# EAGLE design tsc (EAGLE 9.7.0)
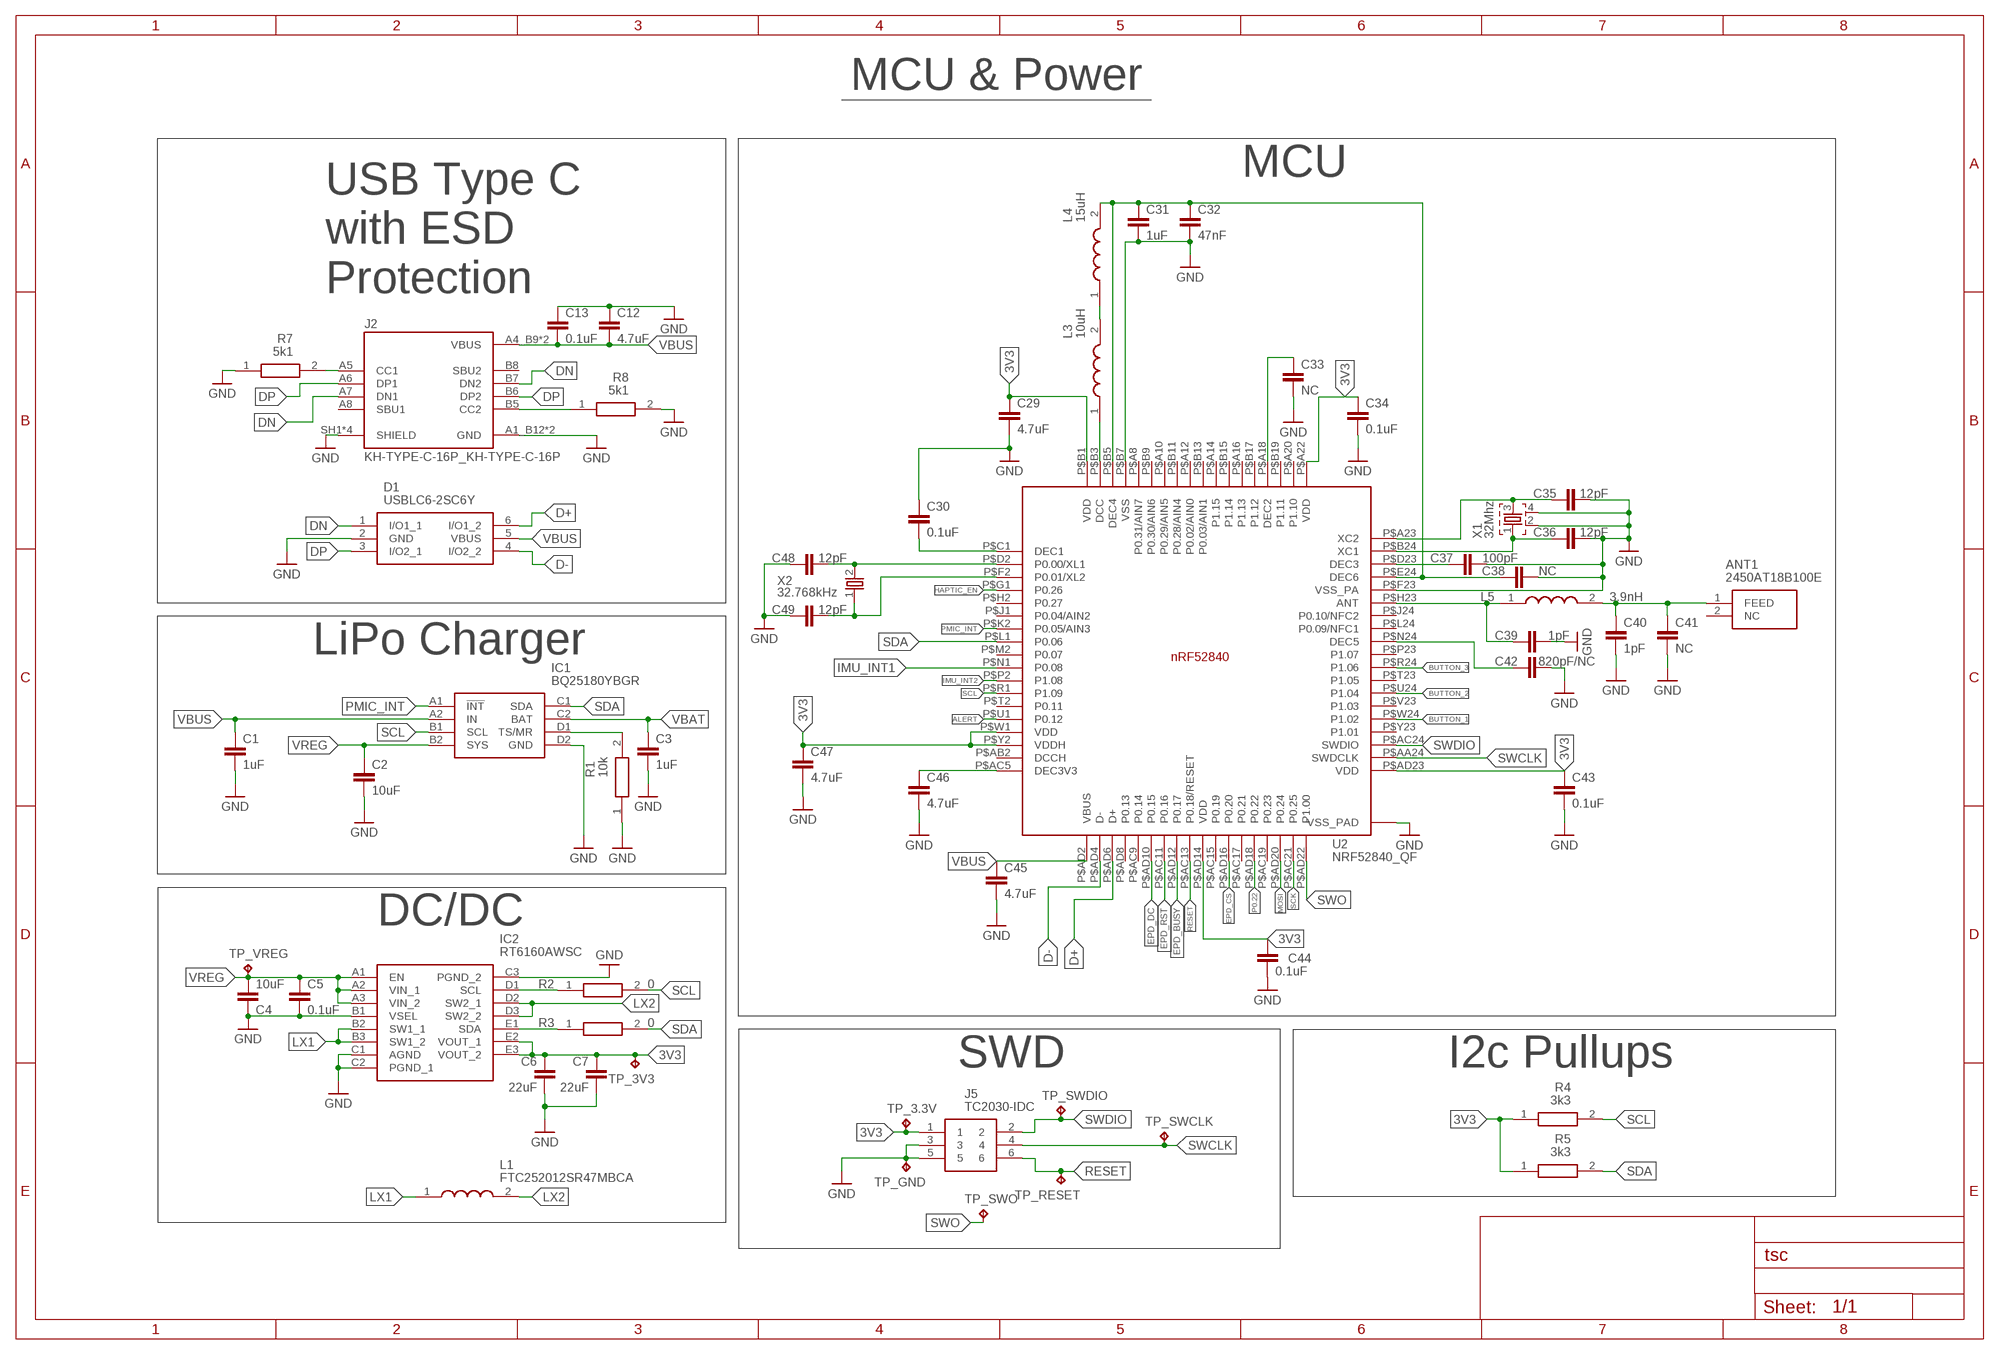
[diagram p0: schematic, sheet 1, part 1 of 2]
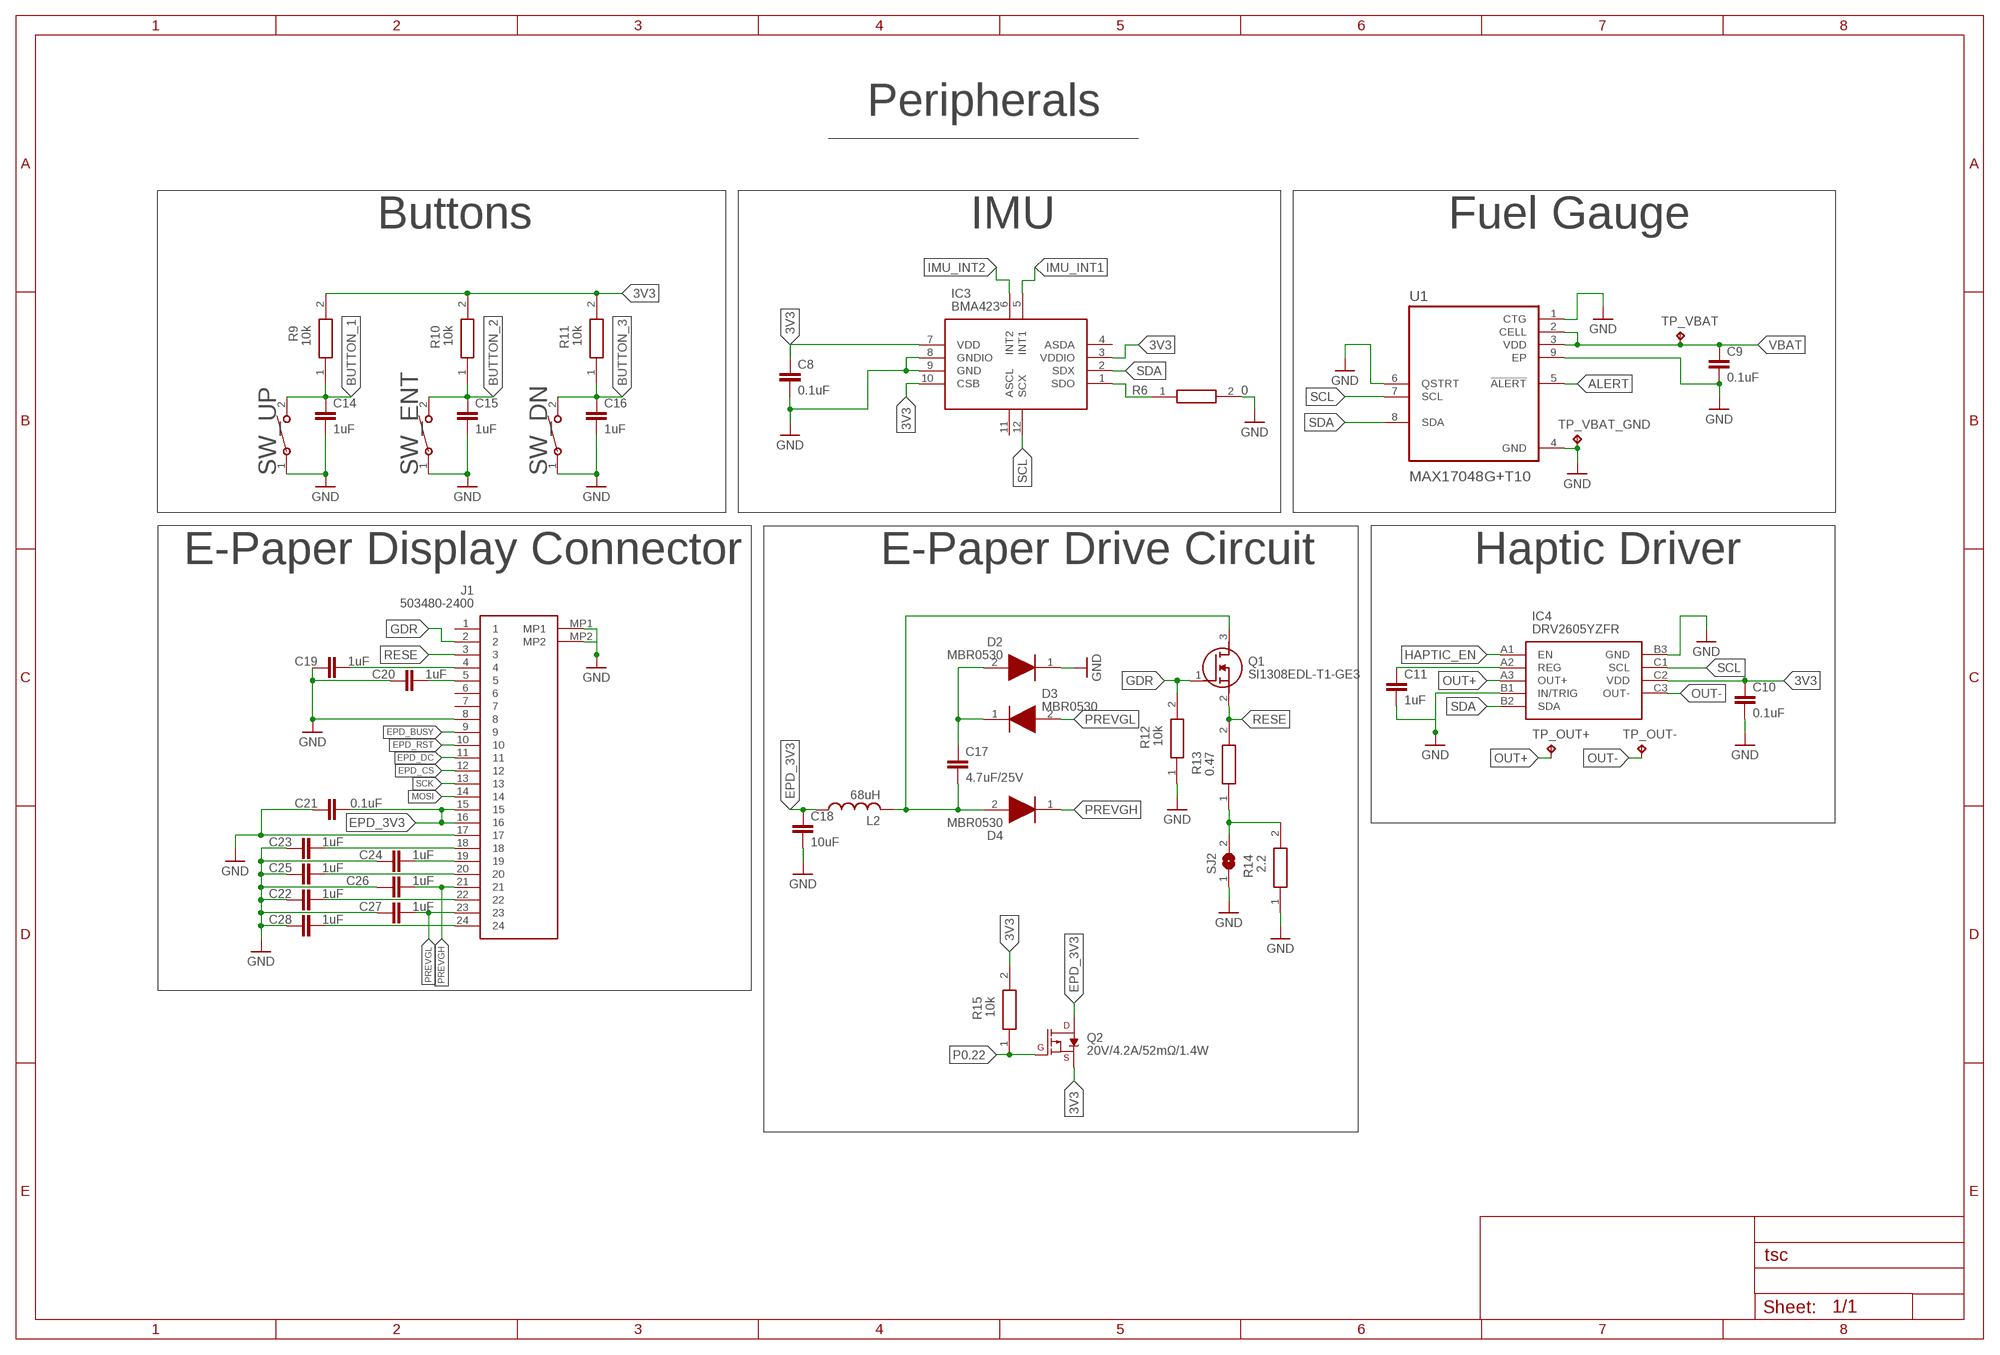
[diagram p1: schematic, sheet 1, part 2 of 2]

## Parts
ANT1  2450AT18B100E  2450AT18B100E_2450AT18B100E  [2450AT18B100E_ANTC3216X140N]
C1  1uF  NORDIC_NRF_3_CAPACITOR_0402_N  [NORDIC_NRF_3_RESC0402_N]
C2  10uF  NORDIC_NRF_3_CAPACITOR_0402_N  [NORDIC_NRF_3_RESC0402_N]
C3  1uF  NORDIC_NRF_3_CAPACITOR_0402_N  [NORDIC_NRF_3_RESC0402_N]
C4  10uF  NORDIC_NRF_3_CAPACITOR_0402_N  [NORDIC_NRF_3_RESC0402_N]
C5  0.1uF  NORDIC_NRF_3_CAPACITOR_0201_N  [NORDIC_NRF_3_RESC0201_N]
C6  22uF  NORDIC_NRF_3_CAPACITOR_0402_N  [NORDIC_NRF_3_RESC0402_N]
C7  22uF  NORDIC_NRF_3_CAPACITOR_0402_N  [NORDIC_NRF_3_RESC0402_N]
C8  0.1uF  NORDIC_NRF_3_CAPACITOR_0201_N  [NORDIC_NRF_3_RESC0201_N]
C9  0.1uF  NORDIC_NRF_3_CAPACITOR_0201_N  [NORDIC_NRF_3_RESC0201_N]
C10  0.1uF  NORDIC_NRF_3_CAPACITOR_0201_N  [NORDIC_NRF_3_RESC0201_N]
C11  1uF  NORDIC_NRF_3_CAPACITOR_0402_N  [NORDIC_NRF_3_RESC0402_N]
C12  4.7uF  NORDIC_NRF_3_CAPACITOR_0402_N  [NORDIC_NRF_3_RESC0402_N]
C13  0.1uF  NORDIC_NRF_3_CAPACITOR_0201_N  [NORDIC_NRF_3_RESC0201_N]
C14  1uF  NORDIC_NRF_3_CAPACITOR_0402_N  [NORDIC_NRF_3_RESC0402_N]
C15  1uF  NORDIC_NRF_3_CAPACITOR_0402_N  [NORDIC_NRF_3_RESC0402_N]
C16  1uF  NORDIC_NRF_3_CAPACITOR_0402_N  [NORDIC_NRF_3_RESC0402_N]
C17  4.7uF/25V  NORDIC_NRF_3_CAPACITOR_0402_N  [NORDIC_NRF_3_RESC0402_N]
C18  10uF  NORDIC_NRF_3_CAPACITOR_0402_N  [NORDIC_NRF_3_RESC0402_N]
C19  1uF  NORDIC_NRF_3_CAPACITOR_0402_N  [NORDIC_NRF_3_RESC0402_N]
C20  1uF  NORDIC_NRF_3_CAPACITOR_0402_N  [NORDIC_NRF_3_RESC0402_N]
C21  0.1uF  NORDIC_NRF_3_CAPACITOR_0201_N  [NORDIC_NRF_3_RESC0201_N]
C22  1uF  NORDIC_NRF_3_CAPACITOR_0402_N  [NORDIC_NRF_3_RESC0402_N]
C23  1uF  NORDIC_NRF_3_CAPACITOR_0402_N  [NORDIC_NRF_3_RESC0402_N]
C24  1uF  NORDIC_NRF_3_CAPACITOR_0402_N  [NORDIC_NRF_3_RESC0402_N]
C25  1uF  NORDIC_NRF_3_CAPACITOR_0402_N  [NORDIC_NRF_3_RESC0402_N]
C26  1uF  NORDIC_NRF_3_CAPACITOR_0402_N  [NORDIC_NRF_3_RESC0402_N]
C27  1uF  NORDIC_NRF_3_CAPACITOR_0402_N  [NORDIC_NRF_3_RESC0402_N]
C28  1uF  NORDIC_NRF_3_CAPACITOR_0402_N  [NORDIC_NRF_3_RESC0402_N]
C29  4.7uF  NORDIC_NRF_3_CAPACITOR_0402_N  [NORDIC_NRF_3_RESC0402_N]
C30  0.1uF  NORDIC_NRF_3_CAPACITOR_0201_N  [NORDIC_NRF_3_RESC0201_N]
C31  1uF  NORDIC_NRF_3_CAPACITOR_0402_N  [NORDIC_NRF_3_RESC0402_N]
C32  47nF  NORDIC_NRF_3_CAPACITOR_0201_N  [NORDIC_NRF_3_RESC0201_N]
C33  NC  NORDIC_NRF_3_CAPACITOR_0201_N  [NORDIC_NRF_3_RESC0201_N]
C34  0.1uF  NORDIC_NRF_3_CAPACITOR_0201_N  [NORDIC_NRF_3_RESC0201_N]
C35  12pF  NORDIC_NRF_3_CAPACITOR_0201_N  [NORDIC_NRF_3_RESC0201_N]
C36  12pF  NORDIC_NRF_3_CAPACITOR_0201_N  [NORDIC_NRF_3_RESC0201_N]
C37  100pF  NORDIC_NRF_3_CAPACITOR_0201_N  [NORDIC_NRF_3_RESC0201_N]
C38  NC  NORDIC_NRF_3_CAPACITOR_0201_N  [NORDIC_NRF_3_RESC0201_N]
C39  1pF  NORDIC_NRF_3_CAPACITOR_0201_N  [NORDIC_NRF_3_RESC0201_N]
C40  1pF  NORDIC_NRF_3_CAPACITOR_0201_N  [NORDIC_NRF_3_RESC0201_N]
C41  NC  NORDIC_NRF_3_CAPACITOR_0201_N  [NORDIC_NRF_3_RESC0201_N]
C42  820pF/NC  NORDIC_NRF_3_CAPACITOR_0201_N  [NORDIC_NRF_3_RESC0201_N]
C43  0.1uF  NORDIC_NRF_3_CAPACITOR_0201_N  [NORDIC_NRF_3_RESC0201_N]
C44  0.1uF  NORDIC_NRF_3_CAPACITOR_0201_N  [NORDIC_NRF_3_RESC0201_N]
C45  4.7uF  NORDIC_NRF_3_CAPACITOR_0402_N  [NORDIC_NRF_3_RESC0402_N]
C46  4.7uF  NORDIC_NRF_3_CAPACITOR_0402_N  [NORDIC_NRF_3_RESC0402_N]
C47  4.7uF  NORDIC_NRF_3_CAPACITOR_0402_N  [NORDIC_NRF_3_RESC0402_N]
C48  12pF  NORDIC_NRF_3_CAPACITOR_0201_N  [NORDIC_NRF_3_RESC0201_N]
C49  12pF  NORDIC_NRF_3_CAPACITOR_0201_N  [NORDIC_NRF_3_RESC0201_N]
D1  USBLC6-2SC6Y  ESP32_C6_LIBRARY_3_USBLC6-2SC6Y  [ESP32_C6_LIBRARY_3_SOT95P280X145-6N]
D2  MBR0530  ESP32_C6_LIBRARY_5_MBR0530  [ESP32_C6_LIBRARY_5_SOD3716X135N]
D3  MBR0530  ESP32_C6_LIBRARY_5_MBR0530  [ESP32_C6_LIBRARY_5_SOD3716X135N]
D4  MBR0530  ESP32_C6_LIBRARY_5_MBR0530  [ESP32_C6_LIBRARY_5_SOD3716X135N]
IC1  BQ25180YBGR  BQ25180YBGR_BQ25180YBGR  [BQ25180YBGR_BGA8C40P2X4_100X155X50]
IC2  RT6160AWSC  RT6160AWSC_RT6160AWSC  [RT6160AWSC_BGA15C40P3X5_140X230X60]
IC3  BMA423  BMA423_BMA423  [BMA423_BMA423]
IC4  DRV2605YZFR  DRV2605YZFR_DRV2605YZFR  [DRV2605YZFR_BGA9C50P3X3_144X144X62]
J1  503480-2400  503480-2400_503480-2400  [503480-2400_5034802400]
J2  KH-TYPE-C-16P_KH-TYPE-C-16P  [KH-TYPE-C-16P_KINGHELM_KH-TYPE-C-16P]
J5  TC2030-IDC  TC2030-IDC_TC2030-IDC  [TC2030-IDC_TC2030IDC]
L1  FTC252012SR47MBCA  MLP2016SR47MT0S1_FTC252012SR47MBCA  [MLP2016SR47MT0S1_INDC2016X100N]
L2  68uH  NORDIC_NRF_2_INDUCTOR_0402_L  [NORDIC_NRF_2_RESC0402_L]
L3  10uH  MLP2016SR47MT0S1_FTC252012SR47MBCA  [MLP2016SR47MT0S1_INDC2016X100N]
L4  15uH  MLP2016SR47MT0S1_FTC252012SR47MBCA  [MLP2016SR47MT0S1_INDC2016X100N]
L5  3.9nH  MLP2016SR47MT0S1_FTC252012SR47MBCA  [MLP2016SR47MT0S1_INDC2016X100N]
Q1  SI1308EDL-T1-GE3  ESP32_C6_LIBRARY_6_SI1308EDL-T1-GE3  [ESP32_C6_LIBRARY_6_SOT65P210X110-3N]
Q2  20V/4.2A/52mΩ/1.4W  ESP32_C6_LIBRARY_4_ESP32_WROVER_SPARKFUN-DISCRETESEMI_MOSFET_PCH-DMG2305UX-7  [ESP32_C6_LIBRARY_4_ESP32_C6_LIBRARY_4_ESP32_C6_LIBRARY_4_ESP32_C6_LIBRARY_4_ESP32_WROVER_SPARKFUN-DISCRETESEMI_SOT23-3]
R1  10k  CPF0201D7K68C1_CPF0201D7K68C1  [CPF0201D7K68C1_0201]
R2  0  CPF0201D7K68C1_CPF0201D7K68C1  [CPF0201D7K68C1_0201]
R3  0  CPF0201D7K68C1_CPF0201D7K68C1  [CPF0201D7K68C1_0201]
R4  3k3  CPF0201D7K68C1_CPF0201D7K68C1  [CPF0201D7K68C1_0201]
R5  3k3  CPF0201D7K68C1_CPF0201D7K68C1  [CPF0201D7K68C1_0201]
R6  0  CPF0201D7K68C1_CPF0201D7K68C1  [CPF0201D7K68C1_0201]
R7  5k1  CPF0201D7K68C1_CPF0201D7K68C1  [CPF0201D7K68C1_0201]
R8  5k1  CPF0201D7K68C1_CPF0201D7K68C1  [CPF0201D7K68C1_0201]
R9  10k  CPF0201D7K68C1_CPF0201D7K68C1  [CPF0201D7K68C1_0201]
R10  10k  CPF0201D7K68C1_CPF0201D7K68C1  [CPF0201D7K68C1_0201]
R11  10k  CPF0201D7K68C1_CPF0201D7K68C1  [CPF0201D7K68C1_0201]
R12  10k  CPF0201D7K68C1_CPF0201D7K68C1  [CPF0201D7K68C1_0201]
R13  0.47  CPF0201D7K68C1_CPF0201D7K68C1  [CPF0201D7K68C1_0201]
R14  2.2  CPF0201D7K68C1_CPF0201D7K68C1  [CPF0201D7K68C1_0201]
R15  10k  CPF0201D7K68C1_CPF0201D7K68C1  [CPF0201D7K68C1_0201]
SJ2  -  ESP32_C6_LIBRARY_7_JUMPER_SJ  [ESP32_C6_LIBRARY_7_JUMPER_SJ]
SW_DN  2025-10-22_07-23-44_LIBRARY_EVP-AKE31ASW_EVP-AKE31A_PAN  [2025-10-22_07-23-44_LIBRARY_SW_EVP-AKE31A_PAN]
SW_ENT  2025-10-22_07-23-44_LIBRARY_EVP-AKE31ASW_EVP-AKE31A_PAN  [2025-10-22_07-23-44_LIBRARY_SW_EVP-AKE31A_PAN]
SW_UP  2025-10-22_07-23-44_LIBRARY_EVP-AKE31ASW_EVP-AKE31A_PAN  [2025-10-22_07-23-44_LIBRARY_SW_EVP-AKE31A_PAN]
TP_3.3V  HECTOR_WATCH_1_TPTP20R  [HECTOR_WATCH_1_TP20R]
TP_3V3  HECTOR_WATCH_1_TPTP20R  [HECTOR_WATCH_1_TP20R]
TP_GND  HECTOR_WATCH_1_TPTP20R  [HECTOR_WATCH_1_TP20R]
TP_OUT+  HECTOR_WATCH_1_TPTP20R  [HECTOR_WATCH_1_TP20R]
TP_OUT-  HECTOR_WATCH_1_TPTP20R  [HECTOR_WATCH_1_TP20R]
TP_RESET  HECTOR_WATCH_1_TPTP20R  [HECTOR_WATCH_1_TP20R]
TP_SWCLK  HECTOR_WATCH_1_TPTP20R  [HECTOR_WATCH_1_TP20R]
TP_SWDIO  HECTOR_WATCH_1_TPTP20R  [HECTOR_WATCH_1_TP20R]
TP_SWO  HECTOR_WATCH_1_TPTP20R  [HECTOR_WATCH_1_TP20R]
TP_VBAT  HECTOR_WATCH_1_TPTP20R  [HECTOR_WATCH_1_TP20R]
TP_VBAT_GND  HECTOR_WATCH_1_TPTP20R  [HECTOR_WATCH_1_TP20R]
TP_VREG  HECTOR_WATCH_1_TPTP20R  [HECTOR_WATCH_1_TP20R]
U1  MAX17048G+T10  ESP32_C6_LIBRARY_MAX17048G+T10  [ESP32_C6_LIBRARY_SON50P200X200X80-9N]
U2  NRF52840_QF  NORDIC_NRF_4_NRF52840_QF  [NORDIC_NRF_4_AQFN50P700X700X85_HS-74N]
X1  32Mhz  NORDIC_NRF_XTAL_32MHZ  [NORDIC_NRF_BT-XTAL_2016_N]
X2  32.768kHz  NORDIC_NRF_1_XTAL_32KHZ  [NORDIC_NRF_1_XTAL_3215_N]

## Nets
3V3: C6.1 C7.1 C8.1 C10.1 C29.1 C34.1 C43.1 C44.1 C47.1 IC2.E2(VOUT_1) IC2.E3(VOUT_2) IC3.3(VDDIO) IC3.7(VDD) IC3.10(CSB) IC4.C2(VDD) J5.1 Q2.2(S) R4.1 R5.1 R9.2 R10.2 R11.2 R15.2 TP_3.3V.TP TP_3V3.TP U2.P$A22(VDD) U2.P$AD14(VDD) U2.P$AD23(VDD) U2.P$B1(VDD) U2.P$W1(VDD) U2.P$Y2(VDDH)
ALERT: U1.5(!ALERT) U2.P$U1(P0.12)
BUTTON_1: C14.1 R9.1 SW_UP.2 U2.P$W24(P1.02)
BUTTON_2: C15.1 R10.1 SW_ENT.2 U2.P$U24(P1.04)
BUTTON_3: C16.1 R11.1 SW_DN.2 U2.P$R24(P1.06)
D+: D1.6(I/O1_2) U2.P$AD6(D+)
D-: D1.4(I/O2_2) U2.P$AD4(D-)
DN: D1.1(I/O1_1) J2.A7(DN1) J2.B7(DN2)
DP: D1.3(I/O2_1) J2.A6(DP1) J2.B6(DP2)
EPD_3V3: C18.1 C21.2 J1.15 J1.16 L2.1 Q2.3(D)
EPD_BUSY: J1.9 U2.P$AD12(P0.17)
EPD_CS: J1.12 U2.P$AD16(P0.20)
EPD_DC: J1.11 U2.P$AD10(P0.15)
EPD_RST: J1.10 U2.P$AC11(P0.16)
GDR: J1.2 Q1.1(G) R12.2
GND: C1.2 C2.2 C3.2 C4.1 C5.2 C6.2 C7.2 C8.2 C9.2 C10.2 C11.2 C12.1 C13.1 C14.2 C15.2 C16.2 C18.2 C19.1 C20.1 C21.1 C22.1 C23.1 C24.1 C25.1 C26.1 C27.1 C28.1 C29.2 C30.1 C31.2 C32.2 C33.2 C34.2 C35.2 C36.2 C37.2 C38.2 C39.2 C40.2 C41.2 C42.2 C43.2 C44.2 C45.2 C46.2 C47.2 C48.1 C49.1 D1.2(GND) D2.1(K) IC1.D2(GND) IC2.B1(VSEL) IC2.C1(AGND) IC2.C2(PGND_1) IC2.C3(PGND_2) IC3.8(GNDIO) IC3.9(GND) IC4.B1(IN/TRIG) IC4.B3(GND) J1.8 J1.17 J1.MP1 J1.MP2 J2.A1_B12(GND) J2.A12_B1(GND) J2.SH1(SHIELD) J2.SH2(SHIELD) J2.SH3(SHIELD) J2.SH4(SHIELD) J5.3 J5.5 R1.1 R6.2 R7.1 R8.2 R12.1 R14.1 SJ2.1 SW_DN.1 SW_ENT.1 SW_UP.1 TP_GND.TP TP_VBAT_GND.TP U1.1(CTG) U1.4(GND) U1.6(QSTRT) U1.9(EP) U2.P$74(VSS_PAD) U2.P$75(VSS_PAD) U2.P$76(VSS_PAD) U2.P$77(VSS_PAD) U2.P$78(VSS_PAD) U2.P$79(VSS_PAD) U2.P$80(VSS_PAD) U2.P$81(VSS_PAD) U2.P$82(VSS_PAD) U2.P$83(VSS_PAD) U2.P$84(VSS_PAD) U2.P$85(VSS_PAD) U2.P$86(VSS_PAD) U2.P$87(VSS_PAD) U2.P$88(VSS_PAD) U2.P$89(VSS_PAD) U2.P$90(VSS_PAD) U2.P$B7(VSS) U2.P$F23(VSS_PA) X1.2 X1.4
HAPTIC_EN: IC4.A1(EN) U2.P$G1(P0.26)
IMU_INT1: IC3.5(INT1) U2.P$N1(P0.08)
IMU_INT2: IC3.6(INT2) U2.P$P2(P1.08)
LX1: IC2.B2(SW1_1) IC2.B3(SW1_2) L1.1
LX2: IC2.D2(SW2_1) IC2.D3(SW2_2) L1.2
MOSI: J1.14 U2.P$AD20(P0.24)
N$1: IC1.D1(TS/MR) R1.2
N$5: IC2.D1(SCL) R2.1
N$8: IC2.E1(SDA) R3.1
N$20: IC3.1(SDO) R6.1
N$27: C11.1 IC4.A2(REG)
N$31: J2.A5(CC1) R7.2
N$37: C17.1 D2.2(A) D3.1(K)
N$38: J2.B5(CC2) R8.1
N$40: C17.2 D4.2(A) L2.2 Q1.3(D)
N$48: R13.1 R14.2 SJ2.2
N$50: C19.2 J1.4
N$51: C20.2 J1.5
N$54: C23.2 J1.18
N$55: C24.2 J1.19
N$56: C25.2 J1.20
N$58: C22.2 J1.22
N$60: C28.2 J1.24
N$63: C30.2 U2.P$C1(DEC1)
N$64: L3.1 U2.P$B3(DCC)
N$65: L3.2 L4.1
N$66: C31.1 C32.1 C38.1 L4.2 U2.P$B5(DEC4) U2.P$E24(DEC6)
N$71: C33.1 U2.P$A18(DEC2)
N$73: C36.1 U2.P$B24(XC1) X1.1
N$74: C35.1 U2.P$A23(XC2) X1.3
N$75: C37.1 U2.P$D23(DEC3)
N$77: C39.1 L5.1 U2.P$H23(ANT)
N$78: ANT1.1(FEED) C40.1 C41.1 L5.2
N$80: C42.1 U2.P$N24(DEC5)
N$94: C46.1 U2.P$AC5(DEC3V3)
N$103: C48.2 U2.P$D2(P0.00/XL1) X2.2
N$104: C49.2 U2.P$F2(P0.01/XL2) X2.1
OUT+: IC4.A3(OUT+) TP_OUT+.TP
OUT-: IC4.C3(OUT-) TP_OUT-.TP
P0.22: Q2.1(G) R15.1 U2.P$AD18(P0.22)
PMIC_INT: IC1.A1(!INT) U2.P$K2(P0.05/AIN3)
PREVGH: C26.2 D4.1(K) J1.21
PREVGL: C27.2 D3.2(A) J1.23
RESE: J1.3 Q1.2(S) R13.2
RESET: J5.6 TP_RESET.TP U2.P$AC13(P0.18/RESET)
SCK: J1.13 U2.P$AC21(P0.25)
SCL: IC1.B1(SCL) IC3.12(SCX) IC4.C1(SCL) R2.2 R4.2 U1.7(SCL) U2.P$R1(P1.09)
SDA: IC1.C1(SDA) IC3.2(SDX) IC4.B2(SDA) R3.2 R5.2 U1.8(SDA) U2.P$L1(P0.06)
SWCLK: J5.4 TP_SWCLK.TP U2.P$AA24(SWDCLK)
SWDIO: J5.2 TP_SWDIO.TP U2.P$AC24(SWDIO)
SWO: TP_SWO.TP U2.P$AD22(P1.00)
VBAT: C3.1 C9.1 IC1.C2(BAT) TP_VBAT.TP U1.2(CELL) U1.3(VDD)
VBUS: C1.1 C12.2 C13.2 C45.1 D1.5(VBUS) IC1.A2(IN) J2.A4_B9(VBUS) J2.A9_B4(VBUS) U2.P$AD2(VBUS)
VREG: C2.1 C4.2 C5.1 IC1.B2(SYS) IC2.A1(EN) IC2.A2(VIN_1) IC2.A3(VIN_2) TP_VREG.TP
Unconnected: ANT1.2(NC) IC3.4(ASDA) IC3.11(ASCL) J1.1 J1.6 J1.7 J2.A8(SBU1) J2.B8(SBU2) U2.P$A8(P0.31/AIN7) U2.P$A10(P0.29/AIN5) U2.P$A12(P0.02/AIN0) U2.P$A14(P1.15) U2.P$A16(P1.13) U2.P$A20(P1.10) U2.P$AB2(DCCH) U2.P$AC9(P0.14) U2.P$AC15(P0.19) U2.P$AC17(P0.21) U2.P$AC19(P0.23) U2.P$AD8(P0.13) U2.P$B9(P0.30/AIN6) U2.P$B11(P0.28/AIN4) U2.P$B13(P0.03/AIN1) U2.P$B15(P1.14) U2.P$B17(P1.12) U2.P$B19(P1.11) U2.P$H2(P0.27) U2.P$J1(P0.04/AIN2) U2.P$J24(P0.10/NFC2) U2.P$L24(P0.09/NFC1) U2.P$M2(P0.07) U2.P$P23(P1.07) U2.P$T2(P0.11) U2.P$T23(P1.05) U2.P$V23(P1.03) U2.P$Y23(P1.01)

## Notes on the sheet
- MCU & Power
- MCU
- USB Type C
  with ESD
  Protection
- LiPo Charger
- DC/DC
- SWD | I2c Pullups
- Peripherals
- Buttons | IMU | Fuel Gauge
- E-Paper Display Connector | E-Paper Drive Circuit | Haptic Driver

## Library data of the parts
ANT1 = InkTime_v5:2450AT18B100E_2450AT18B100E: Antennas 2.45GHz ANTENNA Source: Datasheet <https://www.johansontechnology.com/datasheets/2450AT18B100/2450AT18B100.pdf>; ARROW_PART_NUMBER: 2450AT18B100E; ARROW_PRICE-STOCK: https://www.arrow.com/en/products/2450at18b100e/johanson-dielectrics?utm_currency=USD&region=nac; DESCRIPTION: Antennas 2.45GHz ANTENNA; HEIGHT: 1.4mm; MANUFACTURER_NAME: JOHANSON TECHNOLOGY; MANUFACTURER_PART_NUMBER: 2450AT18B100E; MOUSER_PART_NUMBER: 609-2450AT18B100E; MOUSER_PRICE-STOCK: https://www.mouser.co.uk/ProductDetail/Johanson-Technology/2450AT18B100E?qs=yCnrNFeXz%252Bh5MFsFIXGZGA%3D%3D
C1-C49 = InkTime_v5:NORDIC_NRF_3_CAPACITOR: Generic chip capacitor
D1 = InkTime_v5:ESP32_C6_LIBRARY_3_USBLC6-2SC6Y: Low Cap. ESD Protection Auto SOT-23-6 STMicroelectronics USBLC6-2SC6Y, Dual Uni-Directional TVS Diode Array, 6-Pin SOT-23 Source: Datasheet <https://componentsearchengine.com/Datasheets/1/USBLC6-2SC6Y.pdf> Check availability <https://pricing.snapeda.com/parts/USBLC6-2SC6Y/STMicroelectronics/view-part?ref=eda>; AVAILABILITY: In Stock; CHECK_PRICES: https://www.snapeda.com/parts/USBLC6-2SC6Y/STMicroelectronics/view-part/?ref=eda; DESCRIPTION: 17V Clamp 5A (8/20µs) Ipp Tvs Diode Surface Mount SOT-23-6; MF: STMicroelectronics; MP: USBLC6-2SC6Y; PACKAGE: SOT-23-6 STMicroelectronics; PRICE: None; SNAPEDA_LINK: https://www.snapeda.com/parts/USBLC6-2SC6Y/STMicroelectronics/view-part/?ref=snap
D2-D4 = InkTime_v5:ESP32_C6_LIBRARY_5_MBR0530: ON SEMICONDUCTOR - MBR0530 - DIODE, SCHOTTKY, 0.5A, 30V, SOD-123 Source: Datasheet <http://www.onsemi.com/pub/Collateral/MBR0530T1-D.PDF> Check availability <https://pricing.snapeda.com/parts/MBR0530/ON%20Semiconductor/view-part?ref=eda>; AVAILABILITY: In Stock; CHECK_PRICES: https://www.snapeda.com/parts/MBR0530/Onsemi/view-part/?ref=eda; DESCRIPTION: Diode Schottky 30 V 500mA Surface Mount SOD-123; MF: ON Semiconductor; MP: MBR0530; PACKAGE: SOD-123-2 ON Semiconductor; PRICE: None; PURCHASE-URL: https://www.snapeda.com/api/url_track_click_mouser/?unipart_id=179458&manufacturer=ON Semiconductor&part_name=MBR0530&search_term=None; SNAPEDA_LINK: https://www.snapeda.com/parts/MBR0530/Onsemi/view-part/?ref=snap
IC1 = InkTime_v5:BQ25180YBGR_BQ25180YBGR: Charger IC Lithium Ion/Polymer, Lithium Iron Phosphate 8-DSBGA (1.6x1.1) Source: Datasheet <https://www.ti.com/lit/ds/symlink/bq25180.pdf?ts=1650264094470&ref_url=https%3A%2F%2Fwww.ti.com%2Fproduct%2FBQ25180>; ARROW_PART_NUMBER: BQ25180YBGR; ARROW_PRICE-STOCK: https://www.arrow.com/en/products/bq25180ybgr/texas-instruments?utm_currency=USD&region=nac; DESCRIPTION: Charger IC Lithium Ion/Polymer, Lithium Iron Phosphate 8-DSBGA (1.6x1.1); HEIGHT: 0.5mm; MANUFACTURER_NAME: Texas Instruments; MANUFACTURER_PART_NUMBER: BQ25180YBGR; MOUSER_PART_NUMBER: 595-BQ25180YBGR; MOUSER_PRICE-STOCK: https://www.mouser.co.uk/ProductDetail/Texas-Instruments/BQ25180YBGR?qs=doiCPypUmgEWjAK%252BJAX6Tw%3D%3D
IC2 = InkTime_v5:RT6160AWSC_RT6160AWSC: Buck-Boost Regulator Positive Output Step-Up/Step-Down I2C DC-DC Controller IC 15-WL-CSP (BSC) (1.4x2.3) Source: Datasheet <https://www.richtek.com/SaveDownload.aspx?specid=RT6160A>; DESCRIPTION: Buck-Boost Regulator Positive Output Step-Up/Step-Down I2C DC-DC Controller IC 15-WL-CSP (BSC) (1.4x2.3); HEIGHT: 0.6mm; MANUFACTURER_NAME: RICHTEK; MANUFACTURER_PART_NUMBER: RT6160AWSC; MOUSER_PART_NUMBER: 835-RT6160AWSC; MOUSER_PRICE-STOCK: https://www.mouser.co.uk/ProductDetail/Richtek/RT6160AWSC?qs=amGC7iS6iy%2FLd9PSoixZXQ%3D%3D
IC3 = InkTime_v5:BMA423_BMA423: Accelerometers Triaxial low-g 12bit Acceleration Sensor Source: Datasheet <https://www.mouser.com/datasheet/2/783/BST-BMA423-DS000-1509600.pdf>; ARROW_PART_NUMBER: BMA423; ARROW_PRICE-STOCK: https://www.arrow.com/en/products/bma423/bosch; DESCRIPTION: Accelerometers Triaxial low-g 12bit Acceleration Sensor; HEIGHT: 1mm; MANUFACTURER_NAME: BOSCH; MANUFACTURER_PART_NUMBER: BMA423; MOUSER_PART_NUMBER: 262-BMA423; MOUSER_PRICE-STOCK: https://www.mouser.co.uk/ProductDetail/Bosch-Sensortec/BMA423?qs=HXFqYaX1Q2xC%252BSgeGoX3mg%3D%3D
IC4 = InkTime_v5:DRV2605YZFR_DRV2605YZFR: Haptic Driver for ERM/LRA with Built-In Library and Smart Loop Architecture Source: Datasheet <http://www.ti.com/lit/gpn/drv2605>; ARROW_PART_NUMBER: DRV2605YZFR; ARROW_PRICE-STOCK: https://www.arrow.com/en/products/drv2605yzfr/texas-instruments?region=nac; DESCRIPTION: Haptic Driver for ERM/LRA with Built-In Library and Smart Loop Architecture; HEIGHT: 0.625mm; MANUFACTURER_NAME: Texas Instruments; MANUFACTURER_PART_NUMBER: DRV2605YZFR
J1 = InkTime_v5:503480-2400_503480-2400: FFC & FPC Connectors 0.5mm FPC RA SMT Dual Contact 24Ckt Source: Datasheet <https://componentsearchengine.com/Datasheets/1/503480-2400.pdf>; DESCRIPTION: FFC & FPC Connectors 0.5mm FPC RA SMT Dual Contact 24Ckt; HEIGHT: 1.87mm; MANUFACTURER_NAME: Molex; MANUFACTURER_PART_NUMBER: 503480-2400; MOUSER_PART_NUMBER: 538-503480-2400; MOUSER_PRICE-STOCK: https://www.mouser.co.uk/ProductDetail/Molex/503480-2400?qs=OAhjpuo3Vu7efIoxFh9AOw%3D%3D
J2 = InkTime_v5:KH-TYPE-C-16P_KH-TYPE-C-16P: Check availability <https://pricing.snapeda.com/parts/KH-TYPE-C-16P/kinghelm/view-part?ref=eda>; AVAILABILITY: Not in stock; CHECK_PRICES: https://www.snapeda.com/parts/KH-TYPE-C-16P/Kinghelm/view-part/?ref=eda; MF: kinghelm; MP: KH-TYPE-C-16P; PACKAGE: None; PRICE: None; SNAPEDA_LINK: https://www.snapeda.com/parts/KH-TYPE-C-16P/Kinghelm/view-part/?ref=snap
J5 = InkTime_v5:TC2030-IDC_TC2030-IDC: CABLE ADAPTER 6 POS Source: Datasheet <https://datasheet.datasheetarchive.com/originals/distributors/Datasheets_SAMA/62bc384e093448baaaa63dbd0b9d8707.pdf>; DESCRIPTION: CABLE ADAPTER 6 POS; HEIGHT: 19mm; MANUFACTURER_NAME: Tag Connect; MANUFACTURER_PART_NUMBER: TC2030-IDC
L1 L3-L5 = InkTime_v5:MLP2016SR47MT0S1_FTC252012SR47MBCA: SMD / SMT Inductors (Coils), L=0.47?H, L x W x T : Source: Datasheet <https://product.tdk.com/system/files/dam/doc/product/inductor/inductor/smd/catalog/inductor_commercial_power_mlp2016_en.pdf>; DESCRIPTION: SMD / SMT Inductors (Coils), L=0.47?H, L x W x T :; HEIGHT: 1mm; JLCPCB: https://jlcpcb.com/partdetail/6763488-FTC252012SR47MBCA/C5832368; MANUFACTURER_NAME: TDK; MANUFACTURER_PART_NUMBER: FTC252012SR47MBCA
L2 = InkTime_v5:NORDIC_NRF_2_INDUCTOR: Generic chip inductor
Q1 = InkTime_v5:ESP32_C6_LIBRARY_6_SI1308EDL-T1-GE3: MOSFET N-Ch 30V 1.5A TrenchFET SC70 Vishay Si1308EDL-T1-GE3 N-channel MOSFET Transistor, 1.5 A, 30 V, 3-Pin SC-70 Source: Datasheet <https://componentsearchengine.com/Datasheets/1/SI1308EDL-T1-GE3.pdf> Check availability <https://pricing.snapeda.com/parts/SI1308EDL-T1-GE3/Vishay%20Siliconix/view-part?ref=eda>; AVAILABILITY: In Stock; CHECK_PRICES: https://www.snapeda.com/parts/SI1308EDL-T1-GE3/Vishay+Siliconix/view-part/?ref=eda; DESCRIPTION: Si1308EDL-T1-GE3 N-channel MOSFET Transistor, 1.5 A, 30 V, 3-Pin SC-70 | Siliconix / Vishay SI1308EDL-T1-GE3; MF: Vishay Siliconix; MP: SI1308EDL-T1-GE3; PACKAGE: SOT-323 Vishay Semiconductor; PRICE: None; PURCHASE-URL: https://www.snapeda.com/api/url_track_click_mouser/?unipart_id=274603&manufacturer=Vishay Siliconix&part_name=SI1308EDL-T1-GE3&search_term=None; SNAPEDA_LINK: https://www.snapeda.com/parts/SI1308EDL-T1-GE3/Vishay+Siliconix/view-part/?ref=snap
Q2 = InkTime_v5:ESP32_C6_LIBRARY_4_ESP32_WROVER_SPARKFUN-DISCRETESEMI_MOSFET_PCH: P-channel MOSFETs Voltage controlled devices that allow control of high current outputs. SparkFun Products: SparkFun ESP32 Thing <https://www.sparkfun.com/products/13907> SparkFun ESP8266 Thing <https://www.sparkfun.com/products/13231> SparkFun Pi Servo HAT V2 <https://www.sparkfun.com/products/15316> DMG2305UX-7 (20V/4.2A/SOT23-3); PROD_ID: TRAN-14388
R1-R15 = InkTime_v5:CPF0201D7K68C1_CPF0201D7K68C1: 7.68k 0201 Thin Film Surface Mount Fixed Resistor +/-0.5% 0.031W CPF0201D7K68C1 Source: Datasheet <http://www.te.com/commerce/DocumentDelivery/DDEController?Action=showdoc&DocId=Data Sheet1773200-1ApdfEnglishENG_DS_1773200-1_A.pdf4-2176215-6>
SJ2 = InkTime_v5:ESP32_C6_LIBRARY_7_JUMPER_SJ: SMD solder JUMPER
SW_DN SW_ENT SW_UP = InkTime_v5:2025-10-22_07-23-44_LIBRARY_EVP-AKE31A; COPYRIGHT: Copyright (C) 2025 Ultra Librarian. All rights reserved.; DIGI-KEY_PART_NUMBER_1: P123437TR-ND; DIGI-KEY_PART_NUMBER_2: P123437CT-ND; DIGI-KEY_PART_NUMBER_3: P123437DKR-ND; MANUFACTURER_NAME: Panasonic; MANUFACTURER_PART_NUMBER: EVP-AKE31A
TP_3.3V TP_3V3 TP_GND TP_OUT+ TP_OUT- TP_RESET TP_SWCLK TP_SWDIO TP_SWO TP_VBAT TP_VBAT_GND TP_VREG = InkTime_v5:HECTOR_WATCH_1_TP: Test pad
U1 = InkTime_v5:ESP32_C6_LIBRARY_MAX17048G+T10: Check availability <https://pricing.snapeda.com/parts/MAX17048G%2BT10/Analog%20Devices/view-part?ref=eda>; AVAILABILITY: In Stock; CHECK_PRICES: https://www.snapeda.com/parts/MAX17048G+T10/Analog+Devices/view-part/?ref=eda; DESCRIPTION: 3µA 1-Cell/2-Cell Fuel Gauge with ModelGauge; MF: Analog Devices; MP: MAX17048G+T10; PACKAGE: TDFN-8 Maxim; PRICE: None; PURCHASE-URL: https://www.snapeda.com/api/url_track_click_mouser/?unipart_id=329239&manufacturer=Analog Devices&part_name=MAX17048G+T10&search_term=None; SNAPEDA_LINK: https://www.snapeda.com/parts/MAX17048G+T10/Analog+Devices/view-part/?ref=snap
U2 = InkTime_v5:NORDIC_NRF_4_NRF52840_QF: nRF52840 Features Advanced Single chip 2.4 GHz multi-protocol SoC 32-bit ARM Cortex-M4F Processor 1.7v to 5.5v operation 1MB flash + 256kB RAM Bluetooth 5 support for long range and high throughput 802.15.4 radio support On-chip NFC PPI –Programmable Peripheral Interconnect Automated power management system with automatic power management of each peripheral Configurable I/O mapping for analog and digital I/O 48 x GPIO 1 x QSPI 4 x Master/Slave SPI 2 x Two-wire interface (I²C) I²S interface 2 x UART 4 x PWM USB 2.0 controller ARM TrustZone CryptoCell-310 Cryptographic and security module AES 128-bit ECB/CCM/AAR hardware accelerator Digital microphone interface (PDM) Quadrature decoder 12-bit ADC Low power comparator On-chip 50Ω balun On-air compatible with nRF52, nRF51 and nRF24 Series Applications Advanced high performance wearables Wearables for secure payments Virtual Reality/Augmented Reality systems Smart Home sensor networks Smart city sensor networks High performance HID controllers Internet of Things (IoT) sensor networks Smart door locks Smart lighting networks Connected white goods
X1 = InkTime_v5:NORDIC_NRF_XTAL_32MHZ
X2 = InkTime_v5:NORDIC_NRF_1_XTAL_32KHZ

## Board
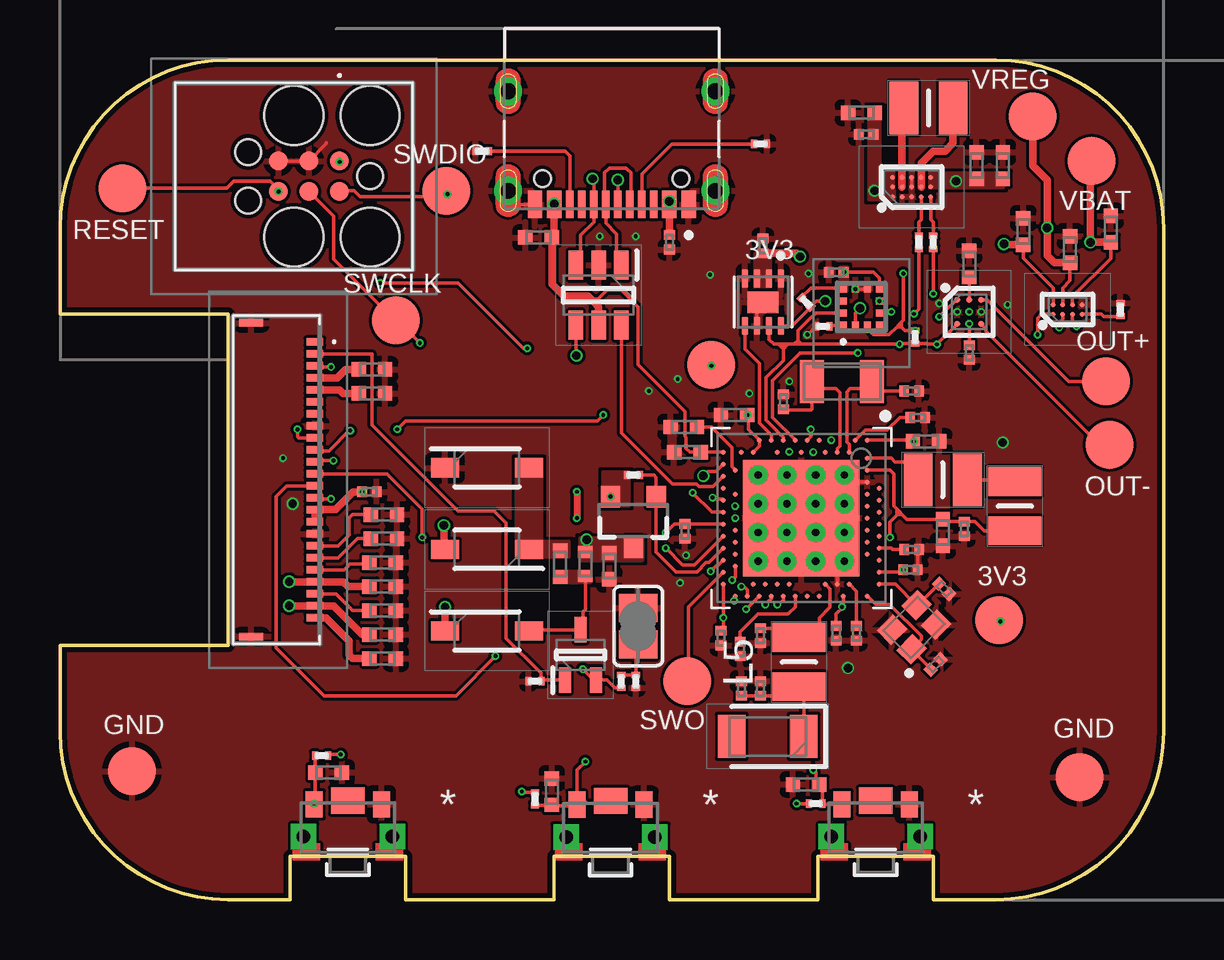
[diagram p2: board, top side]
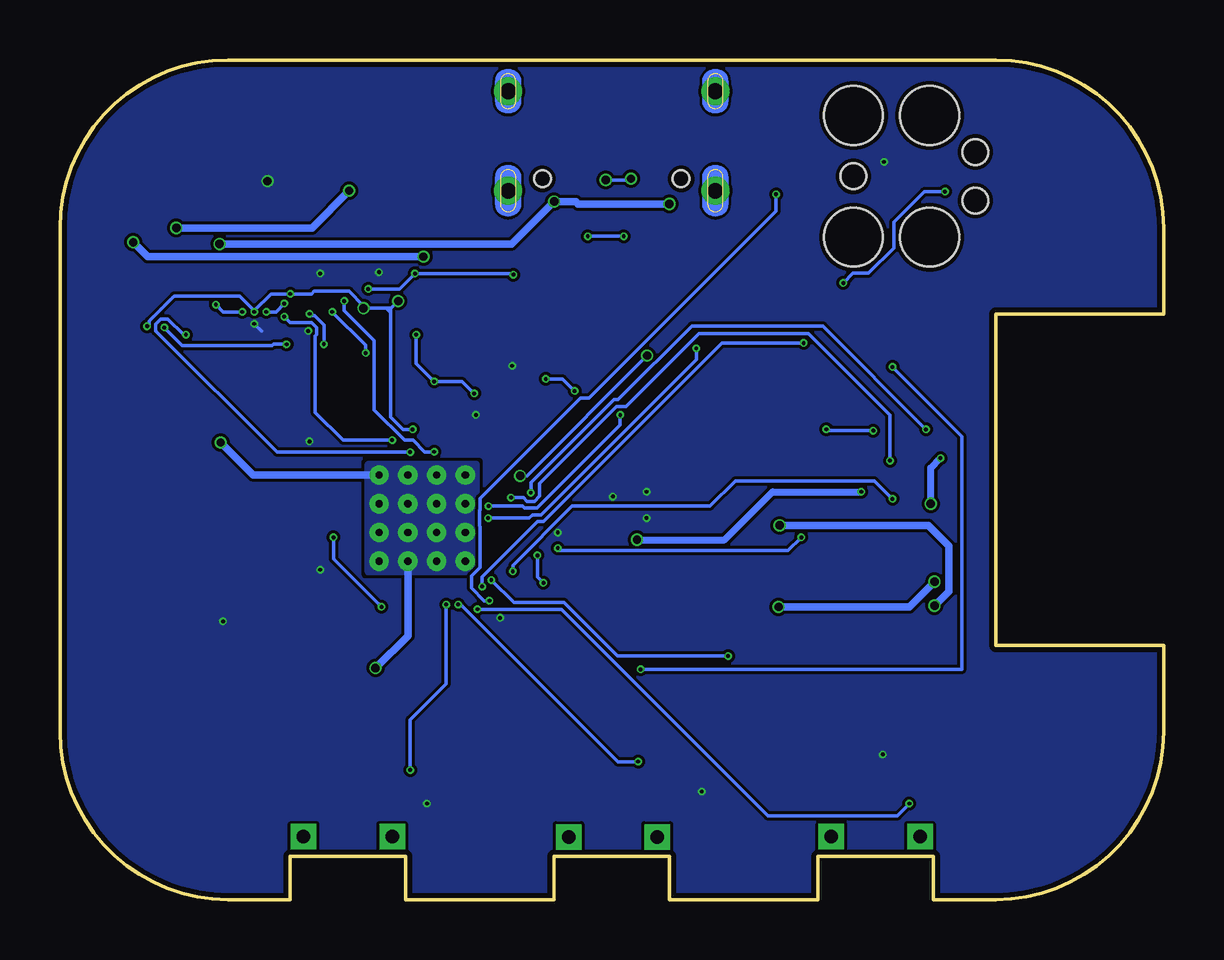
[diagram p3: board, bottom side, seen from below]

Size 46 x 35 mm. Coordinates in mm from the lower left corner, seen from the top.
Outline: 39,0 36.4,0 36.4,1.8 31.6,1.8 31.6,0 25.4,0 25.4,1.8 20.6,1.8 20.6,0 14.4,0 14.4,1.8 9.6,1.8 9.6,0 7,0 arc-90 0,7 0,10.6 7,10.6 7,24.4 0,24.4 0,28 arc-90 7,35 39,35 arc-90 46,28 46,7 arc-90 39,0
Copper layers (1*16): Top 0.035mm / dielectric 1.6mm / Bottom 0.035mm
Design rules "jlcpcb-2layers.dru": minimum track width 0.15mm, minimum drill 0.16mm, track to track 5mil, track to pad 5mil, pad to pad 5mil, via to via 5mil, smd to smd 5mil, copper to edge 0.2mm, drill to drill 6mil, minimum pad ring 10mil, minimum via ring 3mil, stop-mask expansion 4mil, vias tented up to drill 0mil, thermal gap 10mil

### Footprints (pad centres in the part's own frame; a part is rotated, then mirrored left to right if it is on the bottom)
2450AT18B100E_ANTC3216X140N = smd 1.15 x 1.8: 1 -1.5,0; 2 1.5,0
NORDIC_NRF_3_RESC0402_N = smd 0.6 x 0.6: 1 -0.55,0; 2 0.55,0
NORDIC_NRF_3_RESC0201_N = smd 0.4 x 0.45: 1 -0.305,0; 2 0.305,0
ESP32_C6_LIBRARY_3_SOT95P280X145-6N = smd 1.2 x 0.6: 1 -1.25,0.95; 2 -1.25,0; 3 -1.25,-0.95; 4 1.25,-0.95; 5 1.25,0; 6 1.25,0.95
ESP32_C6_LIBRARY_5_SOD3716X135N = smd 1.15 x 0.8: 1 -1.75,0; 2 1.75,0
BQ25180YBGR_BGA8C40P2X4_100X155X50 = smd 0.2 x 0.2: A1 -0.2,0.6; A2 0.2,0.6; B1 -0.2,0.2; B2 0.2,0.2; C1 -0.2,-0.2; C2 0.2,-0.2; D1 -0.2,-0.6; D2 0.2,-0.6
RT6160AWSC_BGA15C40P3X5_140X230X60 = smd 0.216 x 0.216: A1 -0.4,0.8; A2 0,0.8; A3 0.4,0.8; B1 -0.4,0.4; B2 0,0.4; B3 0.4,0.4; C1 -0.4,0; C2 0,0; C3 0.4,0; D1 -0.4,-0.4; D2 0,-0.4; D3 0.4,-0.4; E1 -0.4,-0.8; E2 0,-0.8; E3 0.4,-0.8
BMA423_BMA423 = smd 0.3 x 0.35: 1 -0.75,-0.775; 2 -0.25,-0.775; 3 0.25,-0.775; 4 0.75,-0.775; 7 0.75,0.775; 8 0.25,0.775; 9 -0.25,0.775; 10 -0.75,0.775 | smd 0.35 x 0.3: 5 0.775,-0.25; 6 0.775,0.25; 11 -0.775,0.25; 12 -0.775,-0.25
DRV2605YZFR_BGA9C50P3X3_144X144X62 = smd 0.25 x 0.25: A1 -0.5,0.5; A2 0,0.5; A3 0.5,0.5; B1 -0.5,0; B2 0,0; B3 0.5,0; C1 -0.5,-0.5; C2 0,-0.5; C3 0.5,-0.5
503480-2400_5034802400 = smd 0.3 x 0.7: 1 -5.75,1.525; 2 -5.25,1.525; 3 -4.75,1.525; 4 -4.25,1.525; 5 -3.75,1.525; 6 -3.25,1.525; 7 -2.75,1.525; 8 -2.25,1.525; 9 -1.75,1.525; 10 -1.25,1.525; 11 -0.75,1.525; 12 -0.25,1.525; 13 0.25,1.525; 14 0.75,1.525; 15 1.25,1.525; 16 1.75,1.525; 17 2.25,1.525; 18 2.75,1.525; 19 3.25,1.525; 20 3.75,1.525; 21 4.25,1.525; 22 4.75,1.525; 23 5.25,1.525; 24 5.75,1.525 | smd 0.3 x 1: MP1 -6.54,-1.125; MP2 6.54,-1.125
KH-TYPE-C-16P_KINGHELM_KH-TYPE-C-16P = smd 0.6 x 1.15: A1_B12 -3.2,4.725; A4_B9 -2.4,4.725; A9_B4 2.4,4.725; A12_B1 3.2,4.725 | smd 0.3 x 1.15: A5 -1.25,4.725; A6 -0.25,4.725; A7 0.25,4.725; A8 1.25,4.725; B5 1.75,4.725; B6 0.75,4.725; B7 -0.75,4.725; B8 -1.75,4.725 | drill 0.65 pad 1.05: SH1 -4.32,0; SH2 4.32,0; SH3 -4.32,4.15; SH4 4.32,4.15 | hole 0.7: -2.89,3.65; 2.89,3.65
TC2030-IDC_TC2030IDC = smd 0.783 x 0.783: 1 -0.953,-0.635; 2 -0.953,0.635; 3 0.317,-0.635; 4 0.317,0.635; 5 1.588,-0.635; 6 1.588,0.635 | hole 2.451: -2.223,-2.54; -2.223,2.54; 0.952,-2.54; 0.952,2.54 | hole 1.067: -2.223,0; 2.857,-1.016; 2.857,1.016
MLP2016SR47MT0S1_INDC2016X100N = smd 1.2 x 2.2: 1 -1.028,0; 2 1.028,0
NORDIC_NRF_2_RESC0402_L = smd 0.5 x 0.6: 1 -0.5,0; 2 0.5,0
ESP32_C6_LIBRARY_6_SOT65P210X110-3N = smd 1.05 x 0.5: 1 -1.05,0.65; 2 -1.05,-0.65; 3 1.05,0
ESP32_C6_LIBRARY_4_ESP32_C6_LIBRARY_4_ESP32_C6_LIBRARY_4_ESP32_C6_LIBRARY_4_ESP32_WROVER_SPARKFUN-DISCRETESEMI_SOT23-3 = smd 0.8 x 0.9: 1 -0.95,-1; 2 0.95,-1; 3 0,1.1
CPF0201D7K68C1_0201 = smd 0.35 x 0.25: 1 0,0.275; 2 0,-0.275
ESP32_C6_LIBRARY_7_JUMPER_SJ = smd 1.168 x 1.6: 1 -0.762,0; 2 0.762,0
2025-10-22_07-23-44_LIBRARY_SW_EVP-AKE31A_PAN = smd 0.711 x 1.092: 1 -1.4,-0.972; 2 1.4,-0.972 | drill 0.559 pad 0.914 square: 3 -1.848,0.381; 4 1.848,0.381 | smd 1.397 x 1.092: 5 0,-1.124
HECTOR_WATCH_1_TP20R = smd 2 x 2: TP 0,0
ESP32_C6_LIBRARY_SON50P200X200X80-9N = smd 0.76 x 0.27: 1 -0.985,0.75; 2 -0.985,0.25; 3 -0.985,-0.25; 4 -0.985,-0.75; 5 0.985,-0.75; 6 0.985,-0.25; 7 0.985,0.25; 8 0.985,0.75 | smd 0.9 x 1.3: 9 0,0
NORDIC_NRF_4_AQFN50P700X700X85_HS-74N = smd 4.85 x 4.85: P$74 0,0 | drill 0.3 pad 0.6: P$75 -1.8,1.8; P$76 -0.6,1.8; P$77 0.6,1.8; P$78 1.8,1.8; P$79 -1.8,0.6; P$80 -0.6,0.6; P$81 0.6,0.6; P$82 1.8,0.6; P$83 -1.8,-0.6; P$84 -0.6,-0.6; P$85 0.6,-0.6; P$86 1.8,-0.6; P$87 -1.8,-1.8; P$88 -0.6,-1.8; P$89 0.6,-1.8; P$90 1.8,-1.8 | smd 0.2 x 0.2: P$A8 -1.25,3.25; P$A10 -0.75,3.25; P$A12 -0.25,3.25; P$A14 0.25,3.25; P$A16 0.75,3.25; P$A18 1.25,3.25; P$A20 1.75,3.25; P$A22 2.25,3.25; P$A23 2.75,3.25; P$AA24 3.25,-2.25; P$AB2 -2.75,-2.5; P$AC5 -2,-2.75; P$AC9 -1,-2.75; P$AC11 -0.5,-2.75; P$AC13 0,-2.75; P$AC15 0.5,-2.75; P$AC17 1,-2.75; P$AC19 1.5,-2.75; P$AC21 2,-2.75; P$AC24 3.25,-2.75; P$AD2 -2.75,-3.25; P$AD4 -2.25,-3.25; P$AD6 -1.75,-3.25; P$AD8 -1.25,-3.25; P$AD10 -0.75,-3.25; P$AD12 -0.25,-3.25; P$AD14 0.25,-3.25; P$AD16 0.75,-3.25; P$AD18 1.25,-3.25; P$AD20 1.75,-3.25; P$AD22 2.25,-3.25; P$AD23 2.75,-3.25; P$B1 -3.25,2.75; P$B3 -2.5,2.75; P$B5 -2,2.75; P$B7 -1.5,2.75; P$B9 -1,2.75; P$B11 -0.5,2.75; P$B13 0,2.75; P$B15 0.5,2.75; P$B17 1,2.75; P$B19 1.5,2.75; P$B24 3.25,2.75; P$C1 -3.25,2.25; P$D2 -2.75,2; P$D23 2.75,2; P$E24 3.25,1.75; P$F2 -2.75,1.5; P$F23 2.75,1.5; P$G1 -3.25,1.25; P$H2 -2.75,1; P$H23 2.75,1; P$J1 -3.25,0.75; P$J24 3.25,0.75; P$K2 -2.75,0.5; P$L1 -3.25,0.25; P$L24 3.25,0.25; P$M2 -2.75,0; P$N1 -3.25,-0.25; P$N24 3.25,-0.25; P$P2 -2.75,-0.5; P$P23 2.75,-0.5; P$R1 -3.25,-0.75; P$R24 3.25,-0.75; P$T2 -2.75,-1; P$T23 2.75,-1; P$U1 -3.25,-1.25; P$U24 3.25,-1.25; P$V23 2.75,-1.5; P$W1 -3.25,-1.75; P$W24 3.25,-1.75; P$Y2 -2.75,-2; P$Y23 2.75,-2
NORDIC_NRF_BT-XTAL_2016_N = smd 0.95 x 0.85: 1 -0.725,-0.575; 2 0.725,-0.575; 3 0.725,0.575; 4 -0.725,0.575
NORDIC_NRF_1_XTAL_3215_N = smd 1 x 1.8: 1 -1.25,0; 2 1.25,0

### Placement (x,y rotation side)
ANT1  29.5,6.8 180 top
C1  40.15,27.85 90 top
C2  42.1,27.1 90 top
C3  43.8,27.95 90 top
C4  33.4,32.8 0 top
C5  33.6,31.9 180 top
C6  38.2,30.6 90 top
C7  39.3,30.6 90 top
C8  32.35,26.15 180 top
C9  29.3,27.25 90 top
C10  37.9,22.8 270 top
C11  37.9,26.5 90 top
C12  19.95,27.6 0 top
C13  25.4,27.4 90 top
C14  11.2,5.3 0 top
C15  20.5,4.5 90 top
C16  31.1,4.8 180 top
C17  20.85,14 270 top
C18  22.9,13.9 270 top
C19  13,22.1 180 top
C20  13,21.1 180 top
C21  12.9,17 180 top
C22  13.45,12.05 180 top
C23  13.5,16.05 180 top
C24  13.5,15.05 180 top
C25  13.45,14.05 180 top
C26  13.45,13.05 180 top
C27  13.45,11.05 180 top
C28  13.45,10.05 180 top
C29  36.1,19.1 0 top
C30  35.75,20.1 180 top
C31  36.8,15.3 270 top
C32  37.7,15.45 270 top
C33  35.5,14.6 0 top
C34  35.45,13.75 0 top
C35  36.85,12.95 315 top
C36  36.5,9.8 45 top
C37  33.2,11.1 270 top
C38  32.35,11.1 270 top
C39  29.2,11 270 top
C40  29.2,8.8 90 top
C41  28.4,8.8 90 top
C42  28.35,10.45 270 top
C43  27.55,10.9 270 top
C44  26.05,15.35 270 top
C45  26.15,18.65 180 top
C46  26,19.7 180 top
C47  28.1,20.2 180 top
C48  35.5,21.2 180 top
C49  30.15,20.75 270 top
D1  22.45,25.2 270 top
D2  17.8,18 0 top
D3  17.8,14.6 180 top
D4  17.8,11.2 0 top
IC1  42,24.6 90 top
IC2  35.5,29.7 90 top
IC3  33.4,24.7 0 top
IC4  37.9,24.5 0 top
J1  9.1,17.5 270 top
J2  23,33.7 180 top
J5  10.7,30.15 180 top
L1  36.2,33 0 top
L2  21.9,14 270 top
L3  36.8,17.5 0 top
L4  39.8,16.4 270 top
L5  30.8,9.9 270 top
Q1  21.7,10.2 90 top
Q2  23.9,15.8 180 top
R1  44.2,24.6 0 top
R2  35.8,27.4 0 top
R3  36.4,27.4 0 top
R4  35.65,23.45 0 top
R5  31.1,24.9 45 top
R6  31.8,23.9 270 top
R7  29.2,31.5 270 top
R8  17.6,31.2 270 top
R9  10.9,6 90 top
R10  19.8,4.2 180 top
R11  31.5,4 270 top
R12  19.8,9.1 90 top
R13  23.4,9.1 0 top
R14  24,9.1 180 top
R15  23.9,17.7 270 top
SJ2  24.1,11.4 270 top
SW_DN  34,3 180 top
SW_ENT  22.95,2.99 180 top
SW_UP  12,3 180 top
TP_3.3V  39.15,11.65 0 top
TP_3V3  27.15,22.3 0 top
TP_GND  3,5.35 0 top
TP_OUT+  43.6,21.6 0 top
TP_OUT-  43.75,18.95 0 top
TP_RESET  2.6,29.65 0 top
TP_SWCLK  14,24.15 0 top
TP_SWDIO  16.1,29.55 0 top
TP_SWO  26.15,9.1 0 top
TP_VBAT  43,30.8 0 top
TP_VBAT_GND  42.5,5.1 0 top
TP_VREG  40.55,32.65 0 top
U1  29.3,24.9 270 top
U2  30.9,15.9 270 top
X1  35.6,11.35 45 top
X2  32.6,21.6 0 top

### Tracks (layer width: path | path; a pad name or v marks a point on that pad's centre or on a via)
3V3  (via drill 0.16, 0.35)
  Top 0.15: IC4.C2 C10.1 | U2.P$A22 35.05,13.65 C34.1 v35.15,13.75 | U2.P$AD23 v27.65,11.74 27.65,11.3 C43.1 | U2.P$Y2 29.15,18.9 U2.P$W1 28.7,19.6 28.7,20.15 C47.1 v28.66,20.2 | U2.P$B1 35.5,19.15 C29.1 v35.6,19.1 | C8.1 33.9,26.15 34.15,25.9 IC3.7 | 32.6,25.6 32.5,25.5 31.3,25.5 30.91,25.11 R5.1 | TP_3V3.TP 27.2,22.3 v27.15,22.25 | v39.2,11.6 TP_3.3V.TP | v35.15,26.1 35.15,24.8 | 35.08,23.88 34.98,23.98 | 35.08,23.88 35.08,24.07 | 35.08,23.88 35.23,23.73 R4.1 v35.65,23.7 | 35.08,23.88 34.88,23.88 | v25.25,15.3 25.61,15.65 C44.1 U2.P$AD14 | J5.1 v11.65,30.75
  Top 0.152: IC3.3 33.65,23.82 33.92,23.55 34.55,23.55 34.88,23.88 34.98,23.98 35.08,24.07 35.15,24.15 35.15,24.8 | R9.2 11.22,6.05 v11.7,6.05 | 19.77,4.5 R10.2 19.27,4.47 v19.25,4.5 | v30.7,4 R11.2
  Top 0.3: v21.55,17 v21.55,15.9
  Bottom 0.15: 37.6,23.7 IC4.C2
  other vias: 37.35,29.95 32.7,26.15 22.95,16.8 37.9,24
  pour Top (rank 2, no thermals): 32.53,25.38 32.82,25.38 32.82,26.37 32.53,26.37 32.53,26.37
  pour Top (rank 2, no thermals): 22.63,16.43 23.72,16.43 23.72,17.82 22.63,17.82
  pour Top (no thermals): 36.23,29.68 39.32,29.68 39.32,30.27 36.23,30.27
  pour Bottom (rank 2): 20.51,1.81 20.53,1.83 25.37,1.83 25.39,1.81 25.41,1.79 25.43,1.77 25.43,0.08 31.47,0.08 31.47,1.82 31.49,1.84 31.51,1.86 31.53,1.88 36.42,1.88 36.44,1.86 36.46,1.84 36.48,1.82 36.48,0.08 38.95,0.08 39.73,0.12 40.49,0.25 41.24,0.46 41.95,0.76 42.63,1.14 43.27,1.59 43.85,2.1 44.36,2.68 44.81,3.32 45.19,4 45.49,4.71 45.7,5.46 45.83,6.22 45.87,7 45.87,27.95 45.83,28.74 45.7,29.51 45.48,30.27 45.18,31 44.8,31.69 44.34,32.33 43.82,32.92 43.23,33.44 42.59,33.9 41.9,34.28 41.17,34.58 40.41,34.8 39.64,34.93 38.85,34.97 7.1,34.97 6.31,34.93 5.53,34.8 4.76,34.58 4.03,34.27 3.34,33.89 2.69,33.43 2.1,32.9 1.57,32.31 1.11,31.66 0.73,30.97 0.42,30.24 0.2,29.47 0.07,28.69 0.03,27.9 0.03,24.48 6.97,24.48 6.99,24.46 7.01,24.44 7.03,24.42 7.03,10.58 7.01,10.56 6.99,10.54 6.97,10.52 0.03,10.52 0.03,6.4 0.07,5.64 0.21,4.89 0.44,4.16 0.75,3.46 1.15,2.81 1.62,2.21 2.16,1.67 2.76,1.2 3.41,0.8 4.11,0.49 4.84,0.26 5.59,0.12 6.35,0.08 9.47,0.08 9.47,1.77 9.49,1.79 9.51,1.81 9.53,1.83 14.37,1.83 14.39,1.81 14.41,1.79 14.43,1.77 14.43,0.08 20.47,0.08 20.47,1.77 20.49,1.79
ALERT
  Top 0.15: U1.5 28.55,22.95 29.15,22.35 29.15,19.87 29.65,19.37 U2.P$U1
BUTTON_1  (via drill 0.16)
  Top 0.15: R9.1 10.62,5.3 | 10.62,5.3 10.62,4 SW_UP.2 v10.6,4 | 10.62,5.3 C14.1 | 10.6,5.3 10.62,5.3 | v28.6,12.1 U2.P$W24 | v10.6,4
  Bottom 0.15: v28.6,12.1 v28.59,12.1 25.1,12.1 16.5,3.5 11.1,3.5 v10.6,4
BUTTON_2  (via drill 0.16)
  Top 0.15: 21.75,3.93 21.75,3.92 | U2.P$U24 29.65,12.55 v29.4,12.3 | SW_ENT.2 21.55,3.72 21.75,3.92 | 21.75,3.92 21.9,4.07 | SW_ENT.2 21.49,3.9 20.5,3.9 C15.1 20.48,3.93 R10.1 | SW_ENT.2 21.55,5.4 v21.9,5.75
  Bottom 0.15: v21.9,5.75 22.75,5.75 29.3,12.3 v29.4,12.3
BUTTON_3  (via drill 0.16)
  Top 0.15: SW_DN.2 31.8,3.97 R11.1 31.77,4.68 C16.1 31.6,4.8 31.5,4.9 31.5,5.3 v31.4,5.4 | v29.9,12.3 29.95,12.3 30.15,12.5 U2.P$R24
  Bottom 0.15: v31.4,5.4 31.4,7.5 29.9,9 v29.9,12.3
D+
  Top 0.15: D1.6 23.4,19.45 25.54,17.32 26.52,17.32 26.63,17.21 27.21,17.21 U2.P$AD6
D-  (via drill 0.35)
  Top 0.15: U2.P$AD4 27.35,17.85 27,17.85 v26.82,17.66 | D1.4 21.5,22.71 v21.53,22.68
  Bottom 0.15: v26.82,17.66 26.54,17.66 v21.53,22.68
DN
  Top 0.15: 23.2,27.05 23.2,26.7 23.4,26.5 D1.1
  Top 0.152: J2.B7 23.8,29.02 23.8,30.3 23.6,30.5 22.9,30.5 22.7,30.3 22.7,29.02 J2.A7 22.75,28.2 23.2,27.75 23.2,27.05
DP  (via drill 0.35)
  Top 0.15: J2.A6 v23.25,30 | v22.2,30.05 22.25,30 J2.B6 22.25,28.25 21.7,27.7 21.7,26.7 21.5,26.5 D1.3
  Bottom 0.15: v23.25,30 22.25,30 v22.2,30.05
EPD_3V3  (via drill 0.16, 0.35)
  Top 0.15: v21.95,15 21.95,14.55 L2.1
  Top 0.305: J1.16 J1.15 10.64,16.26 11.48,16.26 12.22,17 C21.2
  Bottom 0.3: v21.95,15 18.3,15 16.3,17 C21.2
  other vias: 12.6,17
  pour Top (rank 2, no thermals): 21.68,14.13 24.27,14.13 24.27,15.07 21.68,15.07
EPD_BUSY  (via drill 0.16)
  Top 0.15: v9.9,19.6 9.9,19.3 9.95,19.25 J1.9 | v26.38,16.96 27.18,16.15 U2.P$AD12
  Bottom 0.15: v9.9,19.6 14.2,23.9 19.66,23.9 22.73,20.83 22.91,20.83 26.37,17.38 v26.37,16.96 v26.38,16.96
EPD_CS  (via drill 0.16)
  Top 0.15: U2.P$AD16 26.44,13.94 25.96,13.94 v25.25,14.65 | v15.1,15.1 15.1,16.29 13.64,17.75 J1.12
  Bottom 0.15: v15.1,15.1 15.65,14.55 25.15,14.55 v25.25,14.65
EPD_DC  (via drill 0.16)
  Top 0.15: U2.P$AD10 27.6,16.7 27.26,16.7 v27.2,16.76 | v11.4,18.3 10.68,18.3 J1.11
  Bottom 0.15: v11.4,18.3 11.4,20.2 14.8,23.6 19.36,23.6 22.41,20.56 22.8,20.56 26.01,17.34 26.01,16.82 26.23,16.6 26.52,16.6 26.68,16.76 v27.2,16.76
EPD_RST  (via drill 0.16)
  Top 0.15: J1.10 10.68,18.7 11.21,18.7 12.06,19.55 v12.1,19.55 | v14.05,19.6 14.4,19.95 22.4,19.95 v22.65,20.2 | U2.P$AC11 v28.14,16.4
  Bottom 0.15: v12.1,19.55 14,19.55 v14.05,19.6 | v28.14,16.4 26.72,16.4 26.63,16.32 26.12,16.32 22.65,19.78 v22.65,20.2
GDR
  Top 0.15: Q1.1 20.12,9.15 R12.2 20.05,9.1 20.05,9.44 18.6,10.89 18.6,15.7 18.1,16.2 16.59,16.2 13,19.79 13,22.75 J1.2
GND  (via drill 0.16, 0.35)
  Top 0.15: 11.1,31.55 11.1,31.5 J5.3 J5.5 | J2.SH4 18.68,29 18.7,28.98 J2.A12_B1 | U1.6 29.05,24.65 U1.9 | U2.P$74 U2.P$85 | U2.P$B7 33,17.4 U2.P$75 | U2.P$F23 32.4,13.8 U2.P$78 | IC3.8 33.62,25.45 33.17,25.45 IC3.9 v33.15,25.45 | R6.2 31.18,23.55 v31.15,23.55 | C33.2 35.76,14.55 C34.2 | IC2.C3 IC2.C2
  Bottom 0.15: v26.1,14.35 26.1,13.45 v25.85,13.2 | IC4.B3 39.2,24.5 v39.5,24.8 | IC4.B1 37,24.5 v36.65,24.85 | v24.55,21.2 25.05,21.7 v25.75,21.7 | v27.1,26.05 27.15,26.1 v31.2,26.1 31.85,25.45 v33.15,25.45 | v22.5,27.65 v24,27.65 | v31.15,23.55 31.15,22.35 v30.4,21.6 29.24,21.6 v28.74,21.1
  Bottom 0.3: v9.7,16.5 9.7,18 v9.3,18.4
  Bottom 0.305: U2.P$82 31.5,11 v32.85,9.65 | U2.P$75 37.95,17.7 v39.3,19.05
  other vias: 38.4,24.5 37.4,24.5
  pour Top (rank 5): 20.56,1.81 20.58,1.83 25.42,1.83 25.44,1.81 25.46,1.79 25.48,1.77 25.48,0.08 31.52,0.08 31.52,1.82 31.54,1.84 31.56,1.86 31.58,1.88 36.47,1.88 36.49,1.86 36.51,1.84 36.53,1.82 36.53,0.08 39,0.08 39.78,0.12 40.54,0.25 41.29,0.46 42,0.76 42.68,1.14 43.32,1.59 43.9,2.1 44.41,2.68 44.86,3.32 45.24,4 45.54,4.71 45.75,5.46 45.88,6.22 45.92,7 45.92,27.95 45.88,28.74 45.75,29.51 45.53,30.27 45.23,31 44.85,31.69 44.39,32.33 43.87,32.92 43.28,33.44 42.64,33.9 41.95,34.28 41.22,34.58 40.46,34.8 39.69,34.93 38.9,34.97 7.15,34.97 6.36,34.93 5.58,34.8 4.81,34.58 4.08,34.27 3.39,33.89 2.74,33.43 2.15,32.9 1.62,32.31 1.16,31.66 0.78,30.97 0.47,30.24 0.25,29.47 0.12,28.69 0.08,27.9 0.08,24.48 7.02,24.48 7.04,24.46 7.06,24.44 7.08,24.42 7.08,10.58 7.06,10.56 7.04,10.54 7.02,10.52 0.08,10.52 0.08,6.4 0.12,5.64 0.26,4.89 0.49,4.16 0.8,3.46 1.2,2.81 1.67,2.21 2.21,1.67 2.81,1.2 3.46,0.8 4.16,0.49 4.89,0.26 5.64,0.12 6.4,0.08 9.52,0.08 9.52,1.77 9.54,1.79 9.56,1.81 9.58,1.83 14.42,1.83 14.44,1.81 14.46,1.79 14.48,1.77 14.48,0.08 20.52,0.08 20.52,1.77 20.54,1.79
  pour Bottom: 28.65,13.65 33.15,13.65 33.15,18.15 28.65,18.15
HAPTIC_EN  (via drill 0.16)
  Top 0.15: v36.65,24.3 36.89,24.54 36.9,24.54 37.36,25 IC4.A1
  Bottom 0.15: v36.65,24.3 36.41,24.06 35.5,24.06 35.29,23.85 35.29,23.55 35.36,23.48 35.36,20.31 34.2,19.15 U2.P$G1
  other vias: 32.15,19.15
IMU_INT1  (via drill 0.16)
  Top 0.15: IC3.5 34.23,24.5 v34.65,24.5 | v33.26,22.78 30.85,22.78 29.71,21.64 29.71,20.09 U2.P$N1
  Bottom 0.15: v33.26,22.78 33.26,23.11 v34.65,24.5
IMU_INT2  (via drill 0.16)
  Top 0.15: U2.P$P2 v30.4,18.66 | IC3.6 v34.15,24.95
  Bottom 0.15: v34.15,24.95 34.15,24.55 32.9,23.3 32.9,20.41 31.64,19.15 31.29,19.15 30.8,18.66 v30.4,18.66
LX1
  Top 0.305: IC2.B2 IC2.B3 35.1,32.93 L1.1
LX2
  Top 0.305: IC2.D2 IC2.D3 35.9,30.7 36.4,31.2 36.9,31.2 37.23,31.53 L1.2
MOSI  (via drill 0.16)
  Top 0.15: U2.P$AD20 27.4,13.9 27.34,13.9 v27.12,13.68 | v11.3,16.7 10.68,16.7 J1.14
  Bottom 0.15: v11.3,16.7 12.06,17.46 17.84,17.46 18.9,16.4 24.66,16.4 27.12,13.94 v27.12,13.68
N$1
  Top 0.15: IC1.D1 43.4,24.4 43.5,24.3 44.17,24.3 R1.2
N$5
  Top 0.15: IC2.D1 35.9,28.35 35.8,28.25 R2.1
N$8
  Top 0.15: IC2.E1 36.3,28.35 36.4,28.25 R3.1
N$20
  Top 0.15: R6.1 32.1,23.93 IC3.1
N$27
  Top 0.15: C11.1 IC4.A2
N$31
  Top 0.15: J2.A5 24.25,30.25 25.5,31.5 R7.2
N$37
  pour Top (rank 2, no thermals): 19.03,14.28 21.22,14.28 21.22,14.92 19.03,14.92
  pour Top (rank 2, no thermals): 19.03,14.28 20.07,14.28 20.07,18.37 19.03,18.37
N$38
  Top 0.15: J2.B5 21.25,31 21.05,31.2 R8.1
N$40
  Top 0.15: D4.2 19.6,11.25 Q1.3 21.7,11.3 21.8,11.4 21.8,12 21.9,12.1 L2.2
  pour Top (rank 2, no thermals): 20.63,13.23 22.12,13.23 22.12,13.67 20.63,13.67
N$48
  Top 0.15: R13.1 R14.2 24,10.54 SJ2.2
N$50
  Top 0.305: J1.4 11.55,21.75 11.9,22.1 C19.2
N$51
  Top 0.305: J1.5 11.65,21.25 11.8,21.1 C20.2
N$54
  Top 0.15: J1.18 11.6,14.75 12.05,15.2 12.05,15.9 12.2,16.05 C23.2
N$55
  Top 0.15: C24.2 12.4,15.05 11.6,14.25 J1.19
N$56
  Top 0.15: C25.2 12.85,14 12.1,14 11.85,13.75 J1.20
N$58
  Top 0.15: J1.22 11.5,12.75 12.2,12.05 C22.2
N$60
  Top 0.305: J1.24 11.09,11.75 12.05,10.79 12.05,10.2 12.2,10.05 C28.2
N$63
  Top 0.15: C30.2 35,20.1 34.47,19.57 33.57,19.57 U2.P$C1
N$64
  Top 0.15: U2.P$B3 34.65,18.4 34.8,18.25 35.5,18.25 35.5,18.2 35.7,18 35.7,17.5 L3.1
N$65
  Top 0.15: L3.2 39.73,17.5 L4.1
N$66  (via drill 0.16)
  Top 0.15: L4.2 38.53,15.37 38.14,15.75 C32.1 36.89,15.75 C31.1 35.3,15.85 35.1,16.05 | U2.P$B5 34.6,17.9 34.75,17.75 34.75,16.4 34.88,16.27 | U2.P$E24 32.65,12.2 | 32.65,12.2 32.35,11.9 C38.1 | v32.6,12.2 32.65,12.2 | 34.88,16.27 35,16.15 | 35,16.15 35.1,16.05 | v34.6,15.1 34.6,15.75 35,16.15 | 34.77,15.93 34.9,16.05 35.1,16.05 | 34.67,15.82 34.88,16.02 34.88,16.27
  Bottom 0.15: v32.6,12.2 34.6,14.2 v34.6,15.1
N$71
  Top 0.15: C33.1 34.7,14.6 34.65,14.65 U2.P$A18
N$73
  Top 0.15: C36.1 36.28,9.64 X1.1 35.9,10.84 35.9,10.98 34.58,12.3 34,12.3 U2.P$B24
N$74
  Top 0.15: C35.1 35.74,12.27 X1.3 34.83,13.15 U2.P$A23
N$75
  Top 0.15: U2.P$D23 33.2,12.85 C37.1
N$77
  Top 0.15: U2.P$H23 32.1,12.95 32.1,12.2 31.65,11.75 31.65,11.1 | 31.65,11.1 31.65,11.05 | C39.1 30.05,11.3 30.2,11.15 30.2,11.1 30.8,11.1 | 30.8,11.1 L5.1 30.8,11 | 30.8,11.1 31.65,11.1
N$78
  Top 0.15: L5.2 31,8.67 31,8.5 | 31,8.5 ANT1.1 | C41.1 C40.1 | C40.1 30.25,8.49 30.27,8.47 | 30.27,8.47 30.3,8.45 | C40.1 | 31,8.5 30.3,8.5 30.27,8.47
N$80
  Top 0.15: U2.P$N24 30.65,12.2 30.35,11.9 29.08,11.9 28.35,11.17 C42.1
N$94
  Top 0.15: C46.1 27.15,19.7 28,18.85 28,18.05 U2.P$AC5
N$103
  Top 0.15: X2.2 33.75,21.5 33.75,21.3 | 33.75,21.3 32.93,21.3 32.79,21.16 32.79,19.08 32.9,18.97 U2.P$D2 | C48.2 33.85,21.2 33.75,21.3
N$104
  Top 0.15: U2.P$F2 32.4,18.8 32.51,18.91 32.51,21.14 32.35,21.3 31.65,21.3 X2.1 31.35,20.45 31.3,20.4 30.2,20.4 C49.2
OUT+
  Top 0.15: IC4.A3 38.65,25 42.05,21.6 TP_OUT+.TP
OUT-
  Top 0.15: IC4.C3 38.6,23.8 38.6,23.7 43.3,19 43.7,19 TP_OUT-.TP
P0.22
  Top 0.15: R15.1 24.75,17.7 24.85,17.6 Q2.1 24.85,14.49 25.68,13.66 26.56,13.66 26.93,14.04 27.04,14.04 U2.P$AD18
PMIC_INT  (via drill 0.16)
  Top 0.15: v40.75,23.55 40.75,24.25 40.9,24.4 IC1.A1
  Bottom 0.15: v40.75,23.55 40.84,23.55 41.5,24.21 41.8,24.21 42.01,24 42.01,23.7 36.96,18.65 U2.P$K2
  other vias: 31.4,18.65
PREVGH  (via drill 0.35)
  Top 0.305: v9.55,13.25 J1.21 11.8,13.25 12,13.05 C26.2 | v16.05,12.2 D4.1
  Bottom 0.305: v16.05,12.2 10.6,12.2 v9.55,13.25
PREVGL  (via drill 0.35)
  Top 0.305: v9.55,12.25 J1.23 11.4,12.25 12.6,11.05 C27.2 | v16,15.6 16,14.65 D3.2
  Bottom 0.305: v9.55,12.25 8.95,12.85 8.95,14.75 9.8,15.6 v16,15.6
RESE  (via drill 0.16)
  Top 0.15: R13.2 23.12,8.82 22.8,9.15 Q1.2 22.3,9.1 v21.8,9.6 | v11.3,22.2 10.68,22.2 J1.3
  Bottom 0.15: v11.3,22.2 8.4,19.3 8.4,9.6 v21.8,9.6
RESET  (via drill 0.16)
  Top 0.15: J5.6 8.91,29.71 8.9,29.8 8.76,29.94 7.24,29.94 6.95,29.65 TP_RESET.TP | v13.35,25.7 16.6,25.7 19.32,22.98 v19.48,22.98
  Bottom 0.15: v13.35,25.7 12.94,26.11 12.3,26.11 11.25,27.16 11.25,28.23 9.96,29.52 J5.6 | U2.P$AC13 26.44,15.9 26.3,16.04 25.95,16.04 19.48,22.51 v19.48,22.98
  other vias: 28.15,15.9 9.11,29.52
SCK  (via drill 0.16)
  Top 0.15: J1.13 9.45,17.25 9,16.8 9,10.5 11,8.5 16.5,8.5 v18.15,10.15 | U2.P$AC21 28.15,13.45 v28.02,13.32
  Bottom 0.15: v28.02,13.32 27.08,12.38 24.98,12.38 22.76,10.15 v18.15,10.15
SCL  (via drill 0.16)
  Top 0.15: U1.7 29.55,23.35 29.75,23.15 29.95,23.15 | 29.95,23.15 30.15,23.15 | 30.15,23.15 30.35,23.15 | 30.35,23.15 30.6,23.15 | 30.6,23.15 30.75,23.15 | 30.75,23.15 30.9,23.15 | 30.9,23.15 v35,23.15 35.02,23.18 R4.2 36.12,23.18 36.15,23.15 v36.55,23.15 IC4.C1 37.4,23.95 | 30.75,23.15 30.75,23.3 | v41.65,23.85 41.65,24.05 41.8,24.2 IC1.B1 | 30.75,23.3 30.9,23.15 | 30.75,23.3 30.6,23.15 | 30.15,22.95 30.15,23.15 | 30.15,22.95 30.35,23.15 | 30.15,22.95 29.95,23.15 | R2.2 35.8,24.62 v35.6,24.42 | IC3.12 31.5,24.45 31.34,24.29 31.33,24.29 30.75,23.71 30.75,23.3 | U2.P$R1 30.15,19.26 29.43,19.98 29.43,21.76 30.15,22.48 30.15,22.95
  Bottom 0.15: v41.65,23.85 40.9,23.1 37.15,23.1 37.1,23.15 v36.55,23.15 | v35.6,24.42 35.52,24.34 35.39,24.34 35,23.95 v35,23.15
SDA  (via drill 0.16, 0.35)
  Top 0.15: U1.8 30.52,23.91 31.29,24.69 R5.2 31.54,24.95 v31.9,24.95 | v33.35,24.65 33.15,24.45 IC3.2 | U2.P$L1 31.3,19.3 v31.3,19.6 | R3.2 v36.4,25.25 | v42.37,23.9 42.2,24.07 IC1.C1
  Bottom 0.15: 32.4,24.65 v33.35,24.65 33.35,24.75 33.96,25.36 35.4,25.36 35.51,25.25 v36.4,25.25 37.2,25.25 37.9,24.55 | 32.4,24.65 32.22,24.65 | 32.22,24.65 32.2,24.65 v31.9,24.95 | v31.3,19.6 31.7,19.6 32.22,20.12 32.22,24.47 | 32.22,24.65 32.22,24.47 | 32.22,24.47 32.4,24.65 | 37.9,24.55 38.51,25.16 41.24,25.16 42.28,24.11 42.28,23.98 v42.37,23.9 | 37.9,24.55 IC4.B2
  other vias: 37.9,24.5
SWCLK  (via drill 0.16)
  Top 0.15: U2.P$AA24 28.65,12.9 28.5,13.05 v28.4,13.05 | v15,23.2 14,24.2 TP_SWCLK.TP 14,24.1 11.4,26.7 11.4,28.5 10.82,29.07 10.81,29.09 J5.4
  Bottom 0.15: v15,23.2 18.4,23.2 25.84,15.76 26.09,15.76 28.4,13.45 v28.4,13.05
SWDIO  (via drill 0.16)
  Top 0.15: 16.1,29.45 v16.15,29.4 | U2.P$AC24 28.15,12.45 v28.11,12.45 v28.1,12.46 | J5.2 11.69,29.55 12.25,29.55 12.5,29.3 16.1,29.3 16.1,29.45 | 16.1,29.45 TP_SWDIO.TP
  Bottom 0.15: v16.15,29.4 16.15,28.7 23.94,20.91 24.3,20.91 28.49,16.71 28.49,16.25 28.51,16.23 28.51,15.56 28.49,15.55 28.49,13.85 28.85,13.49 28.85,12.99 28.32,12.46 v28.1,12.46
SWO
  Top 0.15: U2.P$AD22 26.2,12.2 26.2,9.1 TP_SWO.TP
VBAT  (via drill 0.35)
  Top 0.15: C3.1 43.8,26.73 42.2,25.12 IC1.C2
  Top 0.305: v30.85,26.8 30.7,26.95 C9.1 | C3.1 v42.95,27.4 42.95,30.75 TP_VBAT.TP
  Bottom 0.305: v30.85,26.8 42.35,26.8 v42.95,27.4
  pour Top (rank 2, no thermals): 28.98,25.53 29.62,25.53 29.62,26.92 28.98,26.92
VBUS  (via drill 0.35)
  Top 0.15: C1.1 40.15,26.75 41.4,25.5 IC1.A2 | U2.P$AD2 C45.1 26.25,18.65 26.1,18.8 26.1,19.26 26.05,19.32 26.05,20.35 24.1,22.3 24.1,24.7 23.4,25.4 22.8,25.4 22.45,25.05 | v20.6,29 J2.A9_B4 | 22.38,25.02 22.25,24.9 | 22.45,25.05 22.43,25.02 22.38,25.02 | 22.38,25.02 22.12,25.02 | 22.45,25.05 22.45,24.7
  Top 0.305: C13.2 J2.A4_B9 v25.4,29.1 | J2.A9_B4 20.6,27.7 C12.2 20.5,25.65 21,25.15 22,25.15 22.12,25.02 22.25,24.9 22.45,24.7 D1.5 | C1.1 39.38,27.3 v39.35,27.33
  Bottom 0.305: v20.6,29 24.4,29 24.5,29.1 v25.4,29.1 27.17,27.33 v39.35,27.33
VREG  (via drill 0.35)
  Top 0.15: C2.1 42.1,25.8 41.8,25.5 IC1.B2
  Top 0.305: C2.1 41.45,26.55 41.15,26.85 v41.15,28 41.15,30 40.55,30.6 TP_VREG.TP
  Bottom 0.305: v33.95,29.55 35.5,28 v41.15,28
  pour Top (no thermals): 34.77,29.18 34.77,30.37 34.23,30.37 34.21,30.39 34.19,30.41 34.17,30.43 34.17,33.02 33.73,33.02 33.73,29.18

### Text on the board
tPlace: VREG | SWDIO | RESET | VBAT | 3V3 | SWCLK | OUT+ | OUT- | 3V3 | SWO | GND | GND